# EAGLE board M.2 SoM breakout board v0.2-Placement-0305 (EAGLE 9.6.2), part 1 of 2
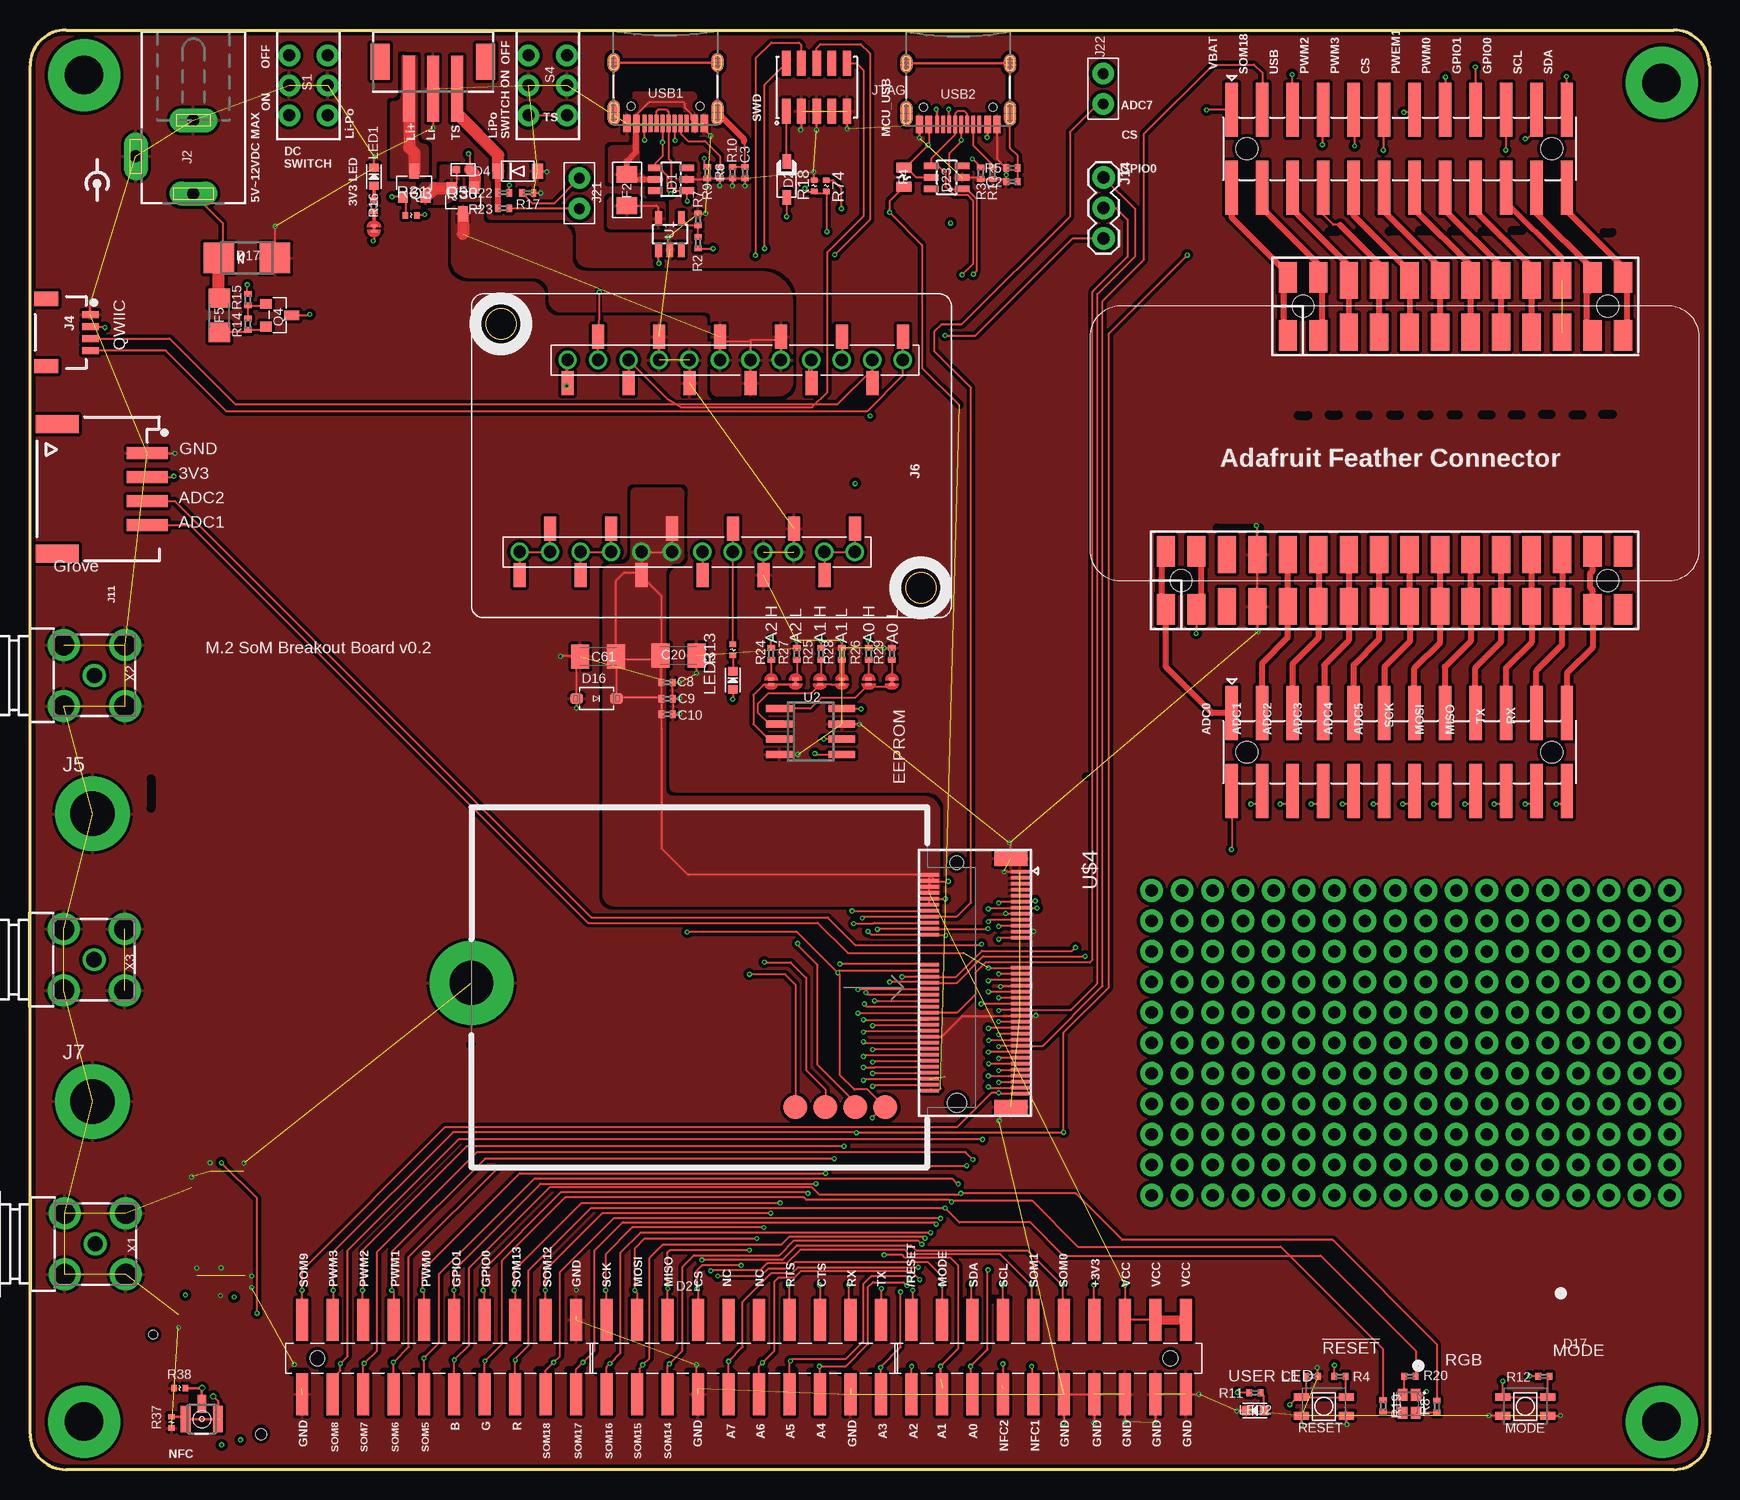
[diagram p3: board, top side]
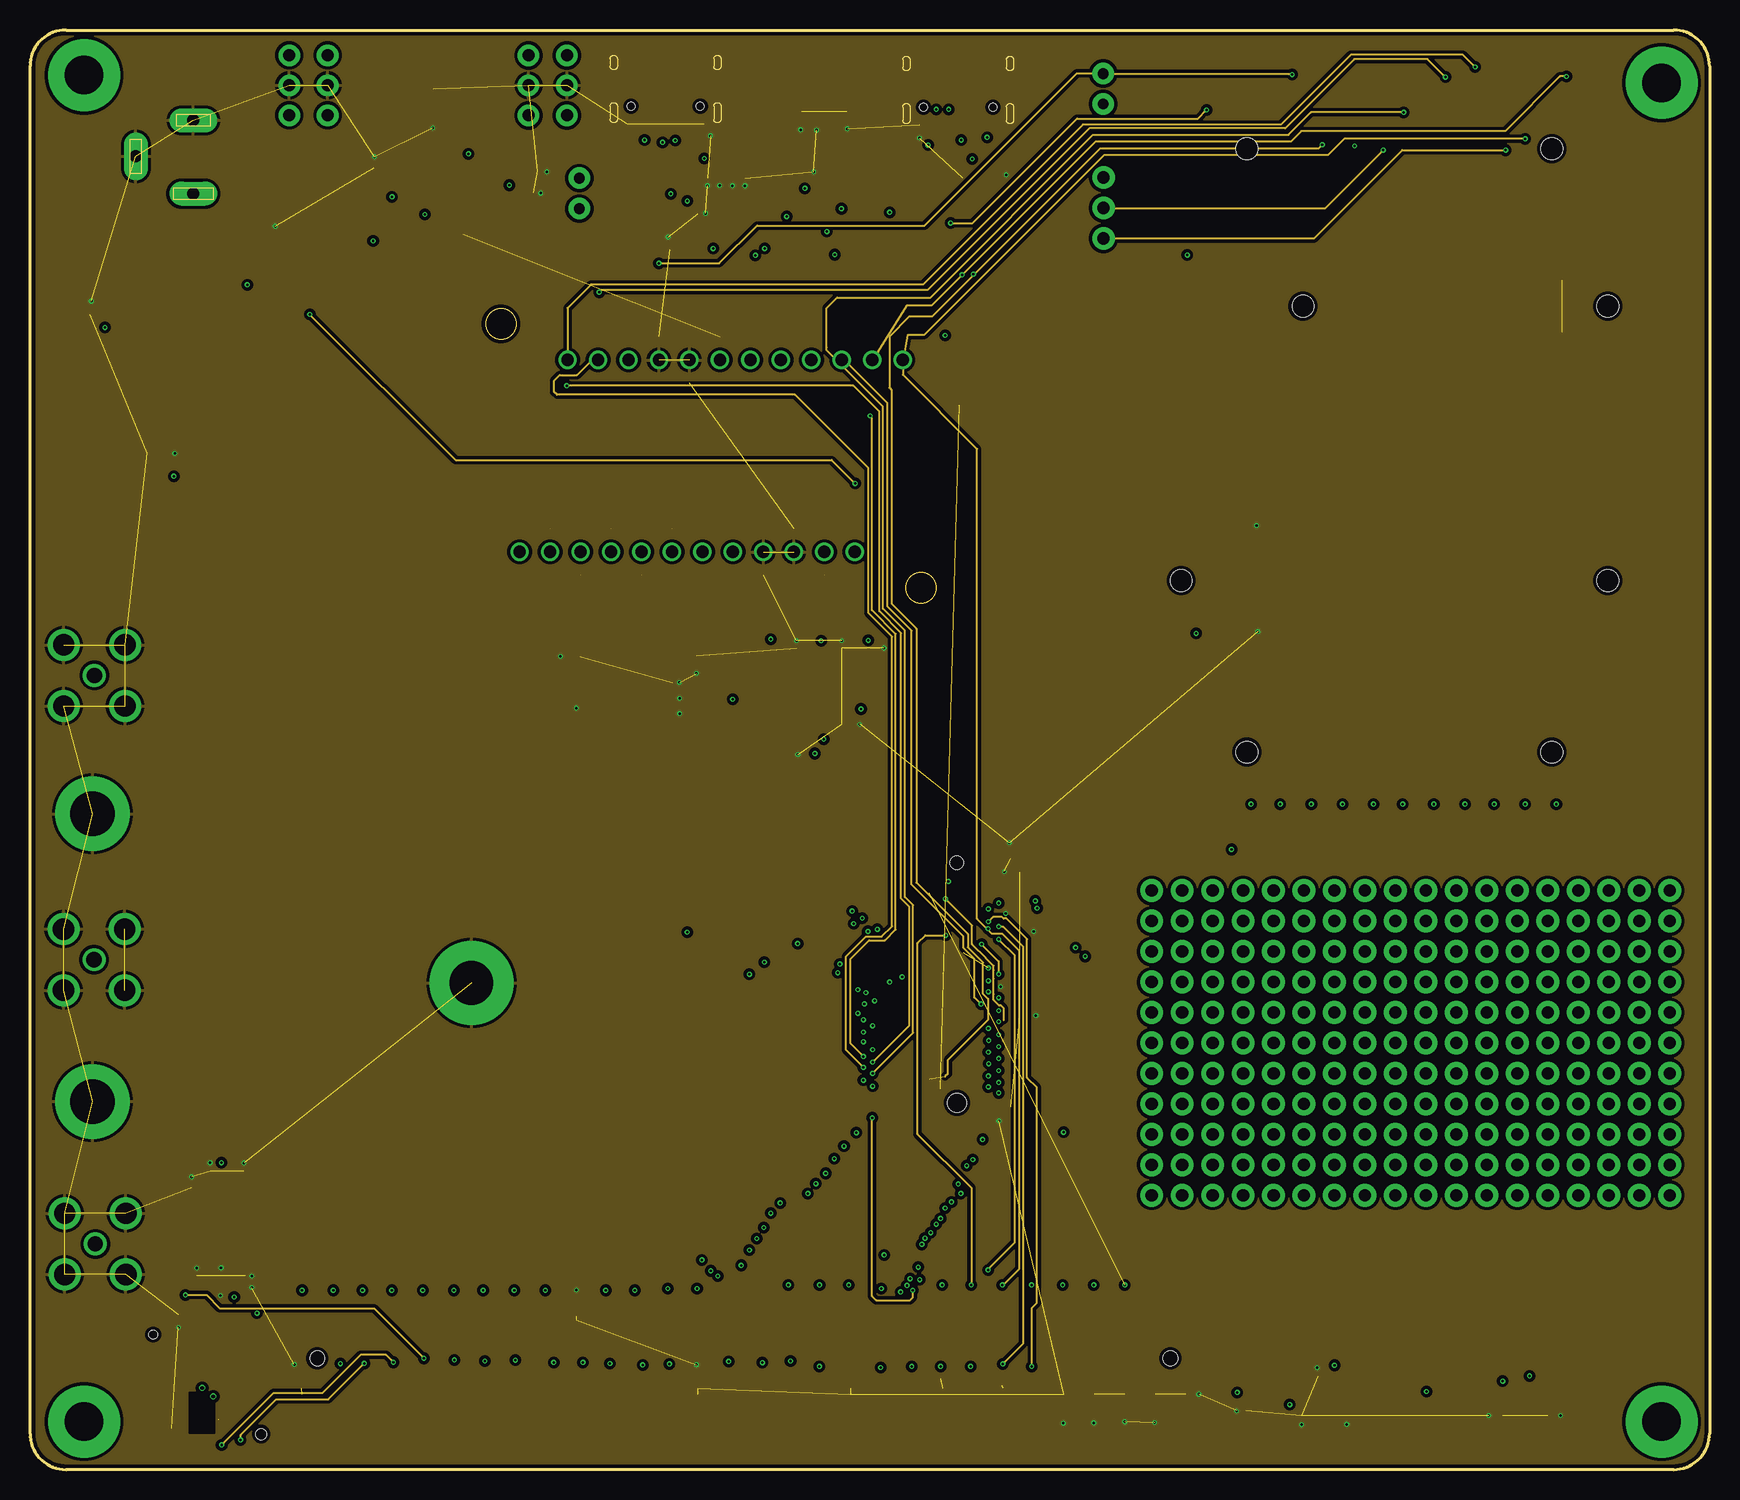
[diagram p4: board, inner layer GND]
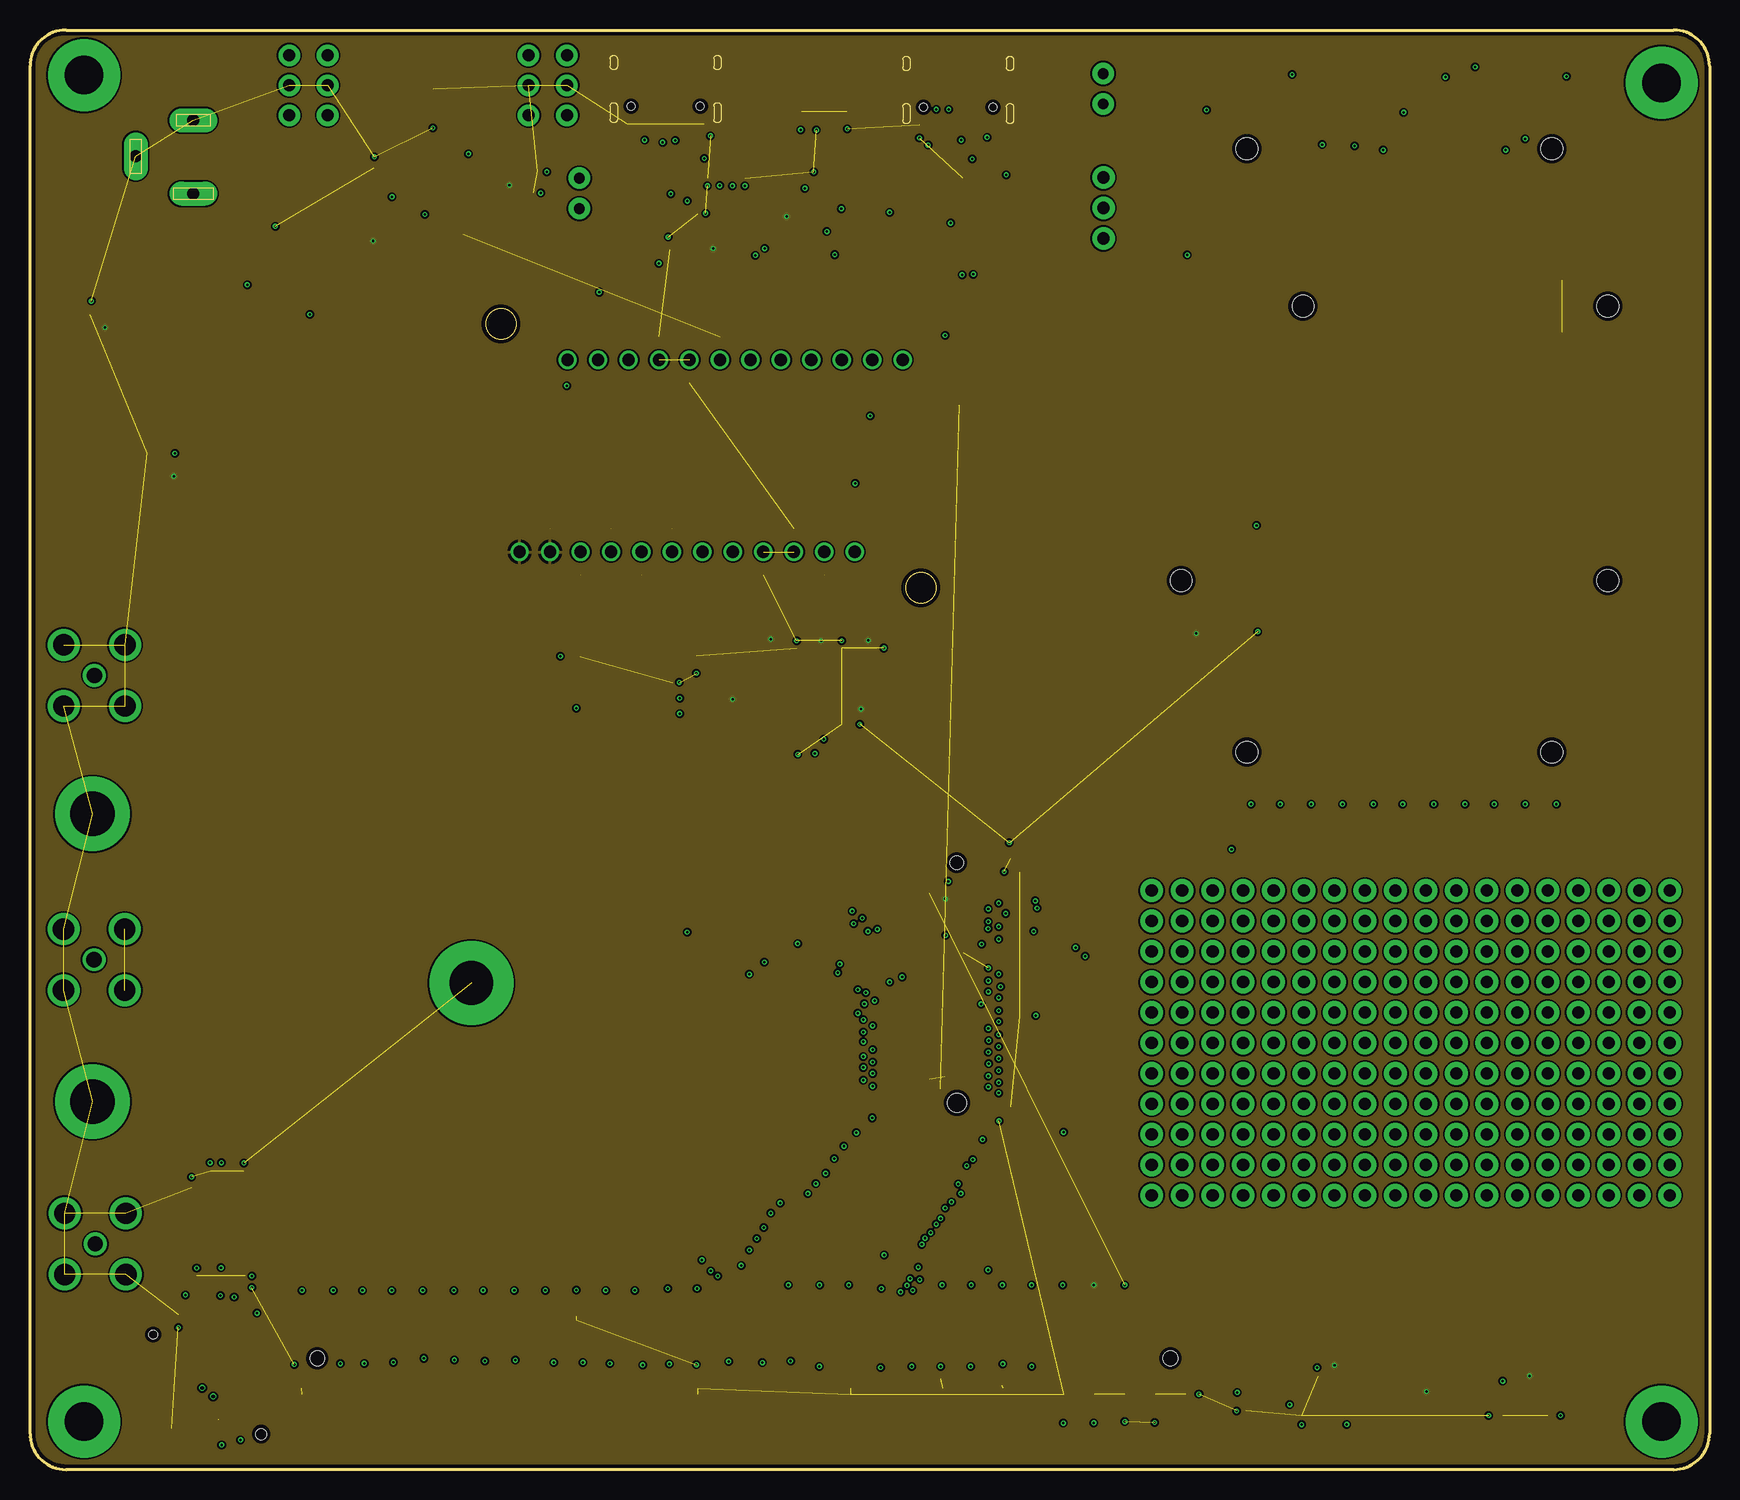
[diagram p5: board, inner layer Route15]
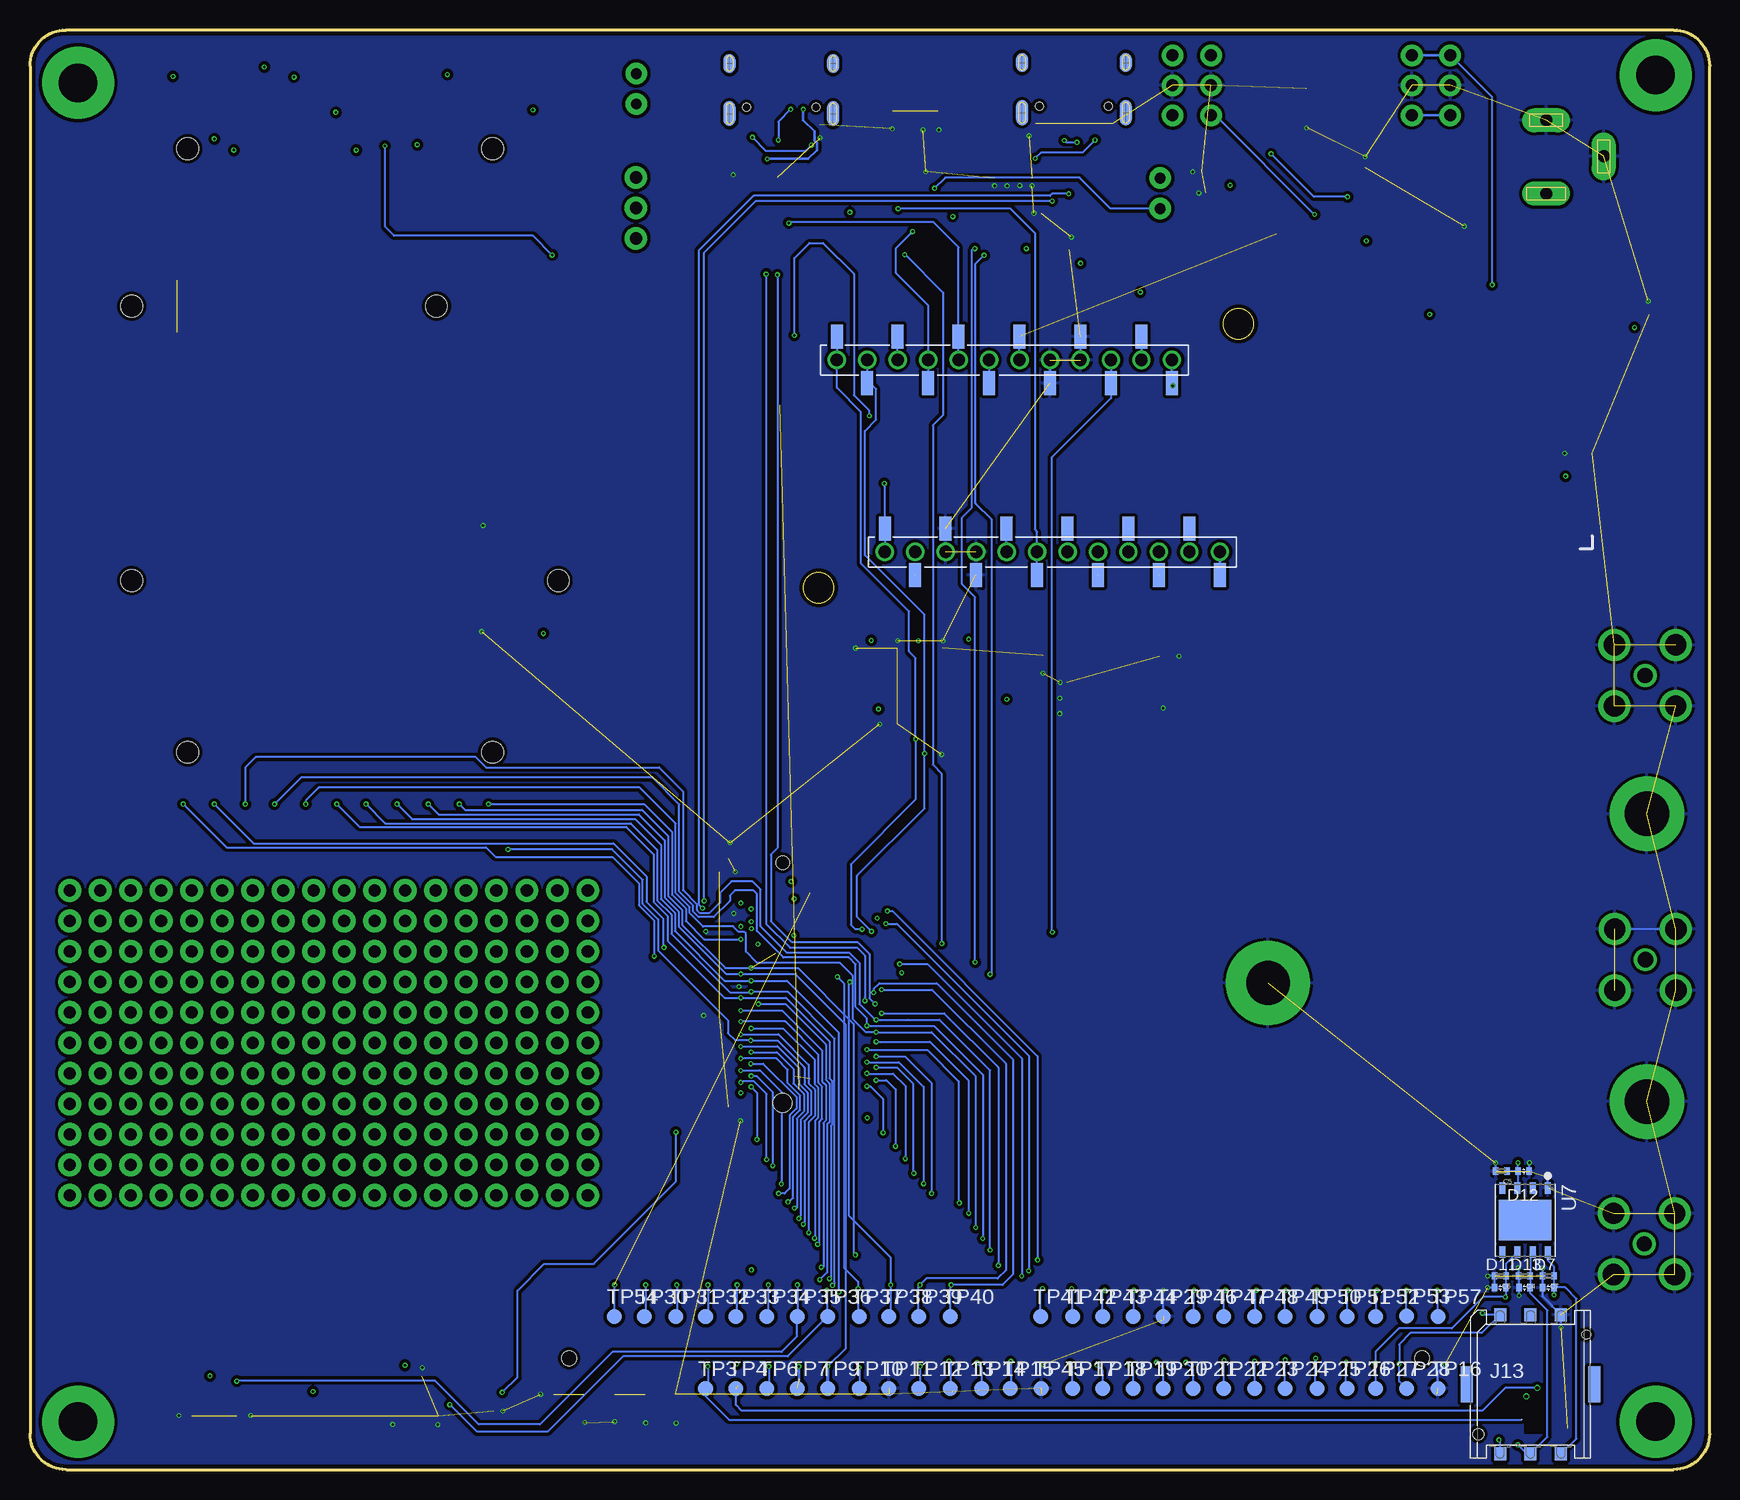
[diagram p6: board, bottom side, seen from below]

Size 140 x 120 mm. Coordinates in mm from the lower left corner, seen from the top.
Outline: 3,120 137,120 arc-90 140,117 140,3 arc-90 137,0 3,0 arc-90 0,3 0,117 arc-90 3,120
Copper layers (1+2*15+16): Top 0.035mm / dielectric 1.5mm / GND 0.035mm / dielectric 0.15mm / Route15 0.035mm / dielectric 0.2mm / Bottom 0.035mm
Design rules "default *": minimum track width 6mil, minimum drill 0.1mm, track to track 6mil, track to pad 6mil, pad to pad 6mil, via to via 6mil, smd to smd 6mil, copper to edge 12mil, drill to drill 6mil, minimum pad ring 4mil, minimum via ring 4mil, stop-mask expansion 4mil, vias tented up to drill 0.35mm, thermal gap 10mil
Net classes: 0 default: width 0.152 mm, clearance 0.152 mm; 1 power: width 0.254 mm, drill 0.61 mm, clearance 0.203 mm; 2 120R_Impedance: width 0.152 mm; 3 BAT: clearance 0.203 mm
tKeepout: 1 lines
tRestrict: 57 lines

## Footprints (pad centres in the part's own frame; a part is rotated, then mirrored left to right if it is on the bottom)
C0402_B = smd 0.457 x 0.61: 1 -0.483,0; 2 0.483,0
C1206K = smd 1.5 x 2: 1 -1.5,0; 2 1.5,0
SOT23-6 = smd 0.55 x 1.2: 1 -0.95,-1.3; 2 0,-1.3; 3 0.95,-1.3; 4 0.95,1.3; 5 0,1.3; 6 -0.95,1.3
SOD-123 = smd 1.2 x 0.7: 1 -1.5,0; 2 1.5,0
SOD-123FL = smd 0.91 x 1.22: A 1.637,0; C -1.637,0
C0402 = smd 0.45 x 0.6: 1 -0.47,0; 2 0.47,0
SOD-123' = smd 1.02 x 0.86: A 1.68,0; C -1.68,0
SMADIODE = smd 2.54 x 2.54: A 2.349,0; C -2.349,0
R1206 = smd 1.4 x 1.7: 1 -1.3,0; 2 1.3,0
F0805 = smd 0.85 x 1.25: P$1 -0.8,0; P$2 0.8,0
R1206' = smd 1.6 x 1.803: 1 -1.422,0; 2 1.422,0
JST-3-SMD-VERT = smd 1 x 5.5: 1 -2,0; 2 0,0; 3 2,0 | smd 1.6 x 3: PAD1 -4.4,-2.25; PAD2 4.4,-2.25
DCJ0202 = drill 1 pad 2 long: 1 0,3.1; 2 4.8,0; 3 0,-3
SPARK_CON_30X2_SMD = smd 1 x 3.5: 1 0,3.013; 2 0,-3.213; 3 2.54,3.013; 4 2.54,-3.213; 5 5.08,3.013; 6 5.08,-3.213; 7 7.62,3.013; 8 7.62,-3.213; 9 10.16,3.013; 10 10.16,-3.213; 11 12.7,3.013; 12 12.7,-3.213; 13 15.24,3.013; 14 15.24,-3.213; 15 17.78,3.013; 16 17.78,-3.213; 17 20.32,3.013; 18 20.32,-3.213; 19 22.86,3.013; 20 22.86,-3.213; 21 25.4,3.013; 22 25.4,-3.213; 23 27.94,3.013; 24 27.94,-3.213; 25 30.48,3.013; 26 30.48,-3.213; 27 33.02,3.013; 28 33.02,-3.213; 29 35.56,3.013; 30 35.56,-3.213; 31 38.1,3.013; 32 38.1,-3.213; 33 40.64,3.013; 34 40.64,-3.213; 35 43.18,3.013; 36 43.18,-3.213; 37 45.72,3.013; 38 45.72,-3.213; 39 48.26,3.013; 40 48.26,-3.213; 41 50.8,3.013; 42 50.8,-3.213; 43 53.34,3.013; 44 53.34,-3.213; 45 55.88,3.013; 46 55.88,-3.213; 47 58.42,3.013; 48 58.42,-3.213; 49 60.96,3.013; 50 60.96,-3.213; 51 63.5,3.013; 52 63.5,-3.213; 53 66.04,3.013; 54 66.04,-3.213; 55 68.58,3.013; 56 68.58,-3.213; 57 71.12,3.013; 58 71.12,-3.213; 59 73.66,3.013; 60 73.66,-3.213 | hole 1.2: 1.27,0; 72.39,0
1X04_1MM_RA = smd 0.6 x 1.35: 1 -1.5,0; 2 -0.5,0; 3 0.5,0; 4 1.5,0 | smd 1.2 x 2: NC1 2.8,-3.675; NC2 -2.8,-3.675
SCREW-HOLE-3.7 = drill 3.7 pad 6.2: P$1 0,0
PARTICLE-SZ_PARTICLE-POWER-MODULE = smd 1 x 2 bottom: 1 31.99,7.45; 2 29.45,3.55; 3 26.91,7.45; 4 24.37,3.55; 5 21.83,7.45; 6 19.29,3.55; 7 16.75,7.45; 8 14.21,3.55; 9 11.67,7.45; 10 9.13,3.55; 11 6.59,7.45; 12 4.05,3.55; 13 35.99,23.45; 14 33.45,19.55; 15 30.91,23.45; 16 28.37,19.55; 17 25.83,23.45; 18 23.29,19.55; 19 20.75,23.45; 20 18.21,19.55; 21 15.67,23.45; 22 13.13,19.55; 23 10.59,23.455; 24 8.05,19.55 | smd 1 x 2: @1 31.99,7.45; @2 29.45,3.55; @3 26.91,7.45; @4 24.37,3.55; @5 21.83,7.45; @6 19.29,3.55; @7 16.75,7.45; @8 14.21,3.55; @9 11.67,7.45; @10 9.13,3.55; @11 6.59,7.45; @12 4.05,3.55; @13 35.99,23.45; @14 33.45,19.55; @15 30.91,23.45; @16 28.37,19.55; @17 25.83,23.45; @18 23.29,19.55; @19 20.75,23.45; @20 18.21,19.55; @21 15.67,23.45; @22 13.13,19.55; @23 10.59,23.45; @24 8.05,19.55 | drill 1.016 pad 1.524: P$1 31.99,5.5; P$2 29.45,5.5; P$3 26.91,5.5; P$4 24.37,5.5; P$5 21.83,5.5; P$6 19.29,5.5; P$7 16.75,5.5; P$8 14.21,5.5; P$9 11.67,5.5; P$10 9.13,5.5; P$11 6.59,5.5; P$12 4.05,5.5; P$13 35.99,21.5; P$14 33.45,21.5; P$15 30.91,21.5; P$16 28.37,21.5; P$17 25.83,21.5; P$18 23.29,21.5; P$19 20.75,21.5; P$20 18.21,21.5; P$21 15.67,21.5; P$22 13.13,21.5; P$23 10.59,21.5; P$24 8.05,21.5
CON_12*2_SMD_HEADER = smd 1.02 x 4.5: 1 0,0.65; 2 0,-5.85; 3 2.54,0.65; 4 2.54,-5.85; 5 5.08,0.65; 6 5.08,-5.85; 7 7.62,0.65; 8 7.62,-5.85; 9 10.16,0.65; 10 10.16,-5.85; 11 12.7,0.65; 12 12.7,-5.85; 13 15.24,0.65; 14 15.24,-5.85; 15 17.78,0.65; 16 17.78,-5.85; 17 20.32,0.65; 18 20.32,-5.85; 19 22.86,0.65; 20 22.86,-5.85; 21 25.4,0.65; 22 25.4,-5.85; 23 27.94,0.65; 24 27.94,-5.85 | hole 1.8: 1.27,-2.6; 26.67,-2.6
WAFER-HY2.0-4PWB = smd 1 x 3.4: 1 -3,3.75; 2 -1,3.75; 3 1,3.75; 4 3,3.75 | smd 1.5 x 3.6: NC1 5.4,-3.75; NC2 -5.4,-3.75
TP_OPEN = smd 0.2 x 0.5: 1 -0.21,0; 2 0.21,0
GCT-SIM8100 = smd 1 x 1.1: C1 2.54,-5.8; C2 0,-5.8; C3 -2.54,-5.8; C5 2.54,5.8; C6 0,5.8; C7 -2.54,5.8 | smd 1 x 3: NC@1 -5.3,0; NC@2 5.3,0 | hole 0.7: 4.65,4.15 | hole 0.9: -4.35,-4.15
1X03 = drill 1.016 pad 1.88: 1 0,0; 2 2.54,0; 3 5.08,0
SIP-2 = drill 0.9 pad 1.8: 1 -1.27,0; 2 1.27,0
CONN5X2_1.27 = smd 0.7 x 2.1: 1 -2.54,-2; 2 -2.54,2; 3 -1.27,-2; 4 -1.27,2; 5 0,-2; 6 0,2; 7 1.27,-2; 8 1.27,2; 9 2.54,-2; 10 2.54,2
LED0603 = smd 0.7 x 0.8: 1 -0.75,0; 2 0.75,0
TACTILE_SWITCH_SMD = smd 1.25 x 0.65: 1 -1.875,0.775; 2 1.875,0.775; 3 -1.875,-0.775; 4 1.875,-0.775
FEATHERWING_SMT2 = smd 1.524 x 2.54: 1 6.35,2.413; 1' 6.35,-2.413; 2 8.89,2.413; 2' 8.89,-2.413; 15 41.91,2.413; 15' 41.91,-2.413; 16 44.45,2.413; 16' 44.45,-2.413; 17 44.45,20.447; 17' 44.45,25.273; 18 41.91,20.447; 18' 41.91,25.273; 27 19.05,20.447; 27' 19.05,25.273; 28 16.51,20.447; 28' 16.51,25.273 | smd 1.524 x 3.048: 3 11.43,2.159; 3' 11.43,-2.159; 4 13.97,2.159; 4' 13.97,-2.159; 5 16.51,2.159; 5' 16.51,-2.159; 6 19.05,2.159; 6' 19.05,-2.159; 7 21.59,2.159; 7' 21.59,-2.159; 8 24.13,2.159; 8' 24.13,-2.159; 9 26.67,2.159; 9' 26.67,-2.159; 10 29.21,2.159; 10' 29.21,-2.159; 11 31.75,2.159; 11' 31.75,-2.159; 12 34.29,2.159; 12' 34.29,-2.159; 13 36.83,2.159; 13' 36.83,-2.159; 14 39.37,2.159; 14' 39.37,-2.159; 19 39.37,20.701; 19' 39.37,25.019; 20 36.83,20.701; 20' 36.83,25.019; 21 34.29,20.701; 21' 34.29,25.019; 22 31.75,20.701; 22' 31.75,25.019; 23 29.21,20.701; 23' 29.21,25.019; 24 26.67,20.701; 24' 26.67,25.019; 25 24.13,20.701; 25' 24.13,25.019; 26 21.59,20.701; 26' 21.59,25.019 | hole 1.8: 17.78,22.86; 43.18,22.86; 7.62,0; 43.18,0
IPEX-20279-001E = smd 0.73 x 1.5: 1 0,1.28 | smd 0.8 x 2.2: 2@1 -1.35,0; 2@2 1.35,0
SOT-23 = smd 0.8 x 0.95: 1 -0.95,-1; 2 0.95,-1 | smd 0.8 x 1.25: 3 0,1.15
R0402_B = smd 0.457 x 0.61: 1 -0.483,0; 2 0.483,0
R-0402S = smd 0.45 x 0.55: 1 -0.47,0; 2 0.47,0
R0603 = smd 0.6 x 0.6: 1 -0.55,0; 2 0.55,0
PLCC4-2MM-RGB = smd 1 x 0.8: BLUE -0.75,-0.55; CA 0.75,-0.55; GREEN -0.75,0.55; RED 0.75,0.55
SWITCH-2.5X3.2-6 = drill 1 pad 1.8: 1 0,0; 2 0,2.5; 3 0,5; 4 3.2,0; 5 3.2,2.5; 6 3.2,5
TP_SHORT = smd 0.2 x 0.5: 1 -0.21,0; 2 0.21,0
B1,27 = smd 1.27 x 1.27: TP 0,0
SOT25 = smd 0.55 x 1.2: 1 -0.95,-1.3; 2 0,-1.3; 3 0.95,-1.3; 4 0.95,1.3; 5 -0.95,1.3
SO-08 = smd 0.6 x 2.2: 1 -1.905,-2.6; 2 -0.635,-2.6; 3 0.635,-2.6; 4 1.905,-2.6; 5 1.905,2.6; 6 0.635,2.6; 7 -0.635,2.6; 8 -1.905,2.6
MFF2 = smd 0.96 x 0.5: 1 -2.675,1.905; 2 -2.675,0.635; 3 -2.675,-0.635; 4 -2.675,-1.905; 5 2.675,-1.905; 6 2.675,-0.635; 7 2.675,0.635; 8 2.675,1.905 | smd 3.4 x 4.4: P$1 0,0
PARTICLE-STUDIOS_PARTICLE_M.2EKEY_3.65MM_DRILL = smd 0.3 x 1.55: 1 -9.62,3.735; 2 -9.37,-3.815; 3 -9.12,3.735; 4 -8.87,-3.815; 5 -8.62,3.735; 6 -8.37,-3.815; 7 -8.12,3.735; 8 -7.87,-3.815; 9 -7.62,3.735; 10 -7.37,-3.815; 11 -7.12,3.735; 12 -6.87,-3.815; 13 -6.62,3.735; 14 -6.37,-3.815; 15 -6.12,3.735; 16 -5.87,-3.815; 17 -5.62,3.735; 18 -5.37,-3.815; 19 -5.12,3.735; 20 -4.87,-3.815; 21 -4.62,3.735; 22 -4.37,-3.815; 23 -4.12,3.735; 32 -1.87,-3.815; 33 -1.62,3.735; 34 -1.37,-3.815; 35 -1.12,3.735; 36 -0.87,-3.815; 37 -0.62,3.735; 38 -0.37,-3.815; 39 -0.12,3.735; 40 0.13,-3.815; 41 0.38,3.735; 42 0.63,-3.815; 43 0.88,3.735; 44 1.13,-3.815; 45 1.38,3.735; 46 1.63,-3.815; 47 1.88,3.735; 48 2.13,-3.815; 49 2.38,3.735; 50 2.63,-3.815; 51 2.88,3.735; 52 3.13,-3.815; 53 3.38,3.735; 54 3.63,-3.815; 55 3.88,3.735; 56 4.13,-3.815; 57 4.38,3.735; 58 4.63,-3.815; 59 4.88,3.735; 60 5.13,-3.815; 61 5.38,3.735; 62 5.63,-3.815; 63 5.88,3.735; 64 6.13,-3.815; 65 6.38,3.735; 66 6.63,-3.815; 67 6.88,3.735; 68 7.13,-3.815; 69 7.38,3.735; 70 7.63,-3.815; 71 7.88,3.735; 72 8.13,-3.815; 73 8.38,3.735; 74 8.63,-3.815; 75 8.88,3.735 | smd 1.2 x 2.75: 76 9.98,2.96; 77 -10.72,2.96 | drill 3.65 pad 7: 78 -0.351,-42 | smd 2 x 2: !RESET 10,-7.5; SWCLK 10,-15; SWDIO 10,-12.5; SWO 10,-10 | hole 1.1: -10.37,-1.54 | hole 1.55: 9.63,-1.54
USB-C-16P = smd 0.3 x 1.45: A5 -1.25,0; A6 -0.25,0; A7 0.25,0; A8 1.25,0; B5 1.75,0; B6 0.75,0; B7 -0.75,0; B8 -1.75,0 | smd 0.6 x 1.45: GND -3.225,0; GND2 3.225,0 | smd 1 x 2.1: SHLD1 -4.32,-0.915; SHLD2 4.32,-0.915 | smd 1 x 2.1 bottom: SHLD3 -4.32,-0.915; SHLD4 4.32,-0.915 | smd 1 x 1.6: SHLD5 -4.32,-5.095; SHLD8 4.32,-5.095 | smd 1 x 1.6 bottom: SHLD6 -4.32,-5.095; SHLD7 4.32,-5.095 | smd 0.55 x 1.45: VBUS1 -2.45,0; VBUS2 2.45,0 | hole 0.65: -2.89,-1.445; 2.89,-1.445
BU-SMA-G = drill 1.27: 1 0,0 | drill 1.778: 2 -2.55,2.55; 3 2.55,2.55; 4 2.55,-2.55; 5 -2.55,-2.55

## Placement (x,y rotation side)
C1  0.1uF  [C0402_B]  106.88,7.78 0 top
C2  0.1uF  [C0402_B]  81.85,107.35 180 top
C3  0.1uF  [C0402_B]  59.61,108.11 270 top
C4  33pF  [C0402_B]  15.43,16.15 180 bottom
C5  33pF  [C0402_B]  17.35,24.87 180 bottom
C6  33pF  [C0402_B]  17.45,16.15 180 bottom
C7  0.1uF  [C0402_B]  13.43,16.15 180 bottom
C8  1nF  [C0402_B]  53.1,65.61 0 top
C9  100pF  [C0402_B]  53.11,64.26 0 top
C10  33pF  [C0402_B]  53.12,62.96 0 top
C20  100uF  [C1206K]  54.05,67.84 0 top
C61  100uF  [C1206K]  47.37,67.76 180 top
D1  TPESD0504S6  [SOT23-6]  53.44,107.55 90 top
D2  B5819w  [SOD-123]  63.07,107.54 90 top
D4  SMF3.3  [SOD-123FL]  40.67,108.23 0 top
D7  0402ESDA-05N  [C0402]  13.43,15.16 0 bottom
D11  0402ESDA-05N  [C0402]  17.45,15.16 0 bottom
D12  0402ESDA-05N  [C0402]  15.5,24.87 180 bottom
D13  0402ESDA-05N  [C0402]  15.42,15.16 0 bottom
D16  BZT52C3V9  [SOD-123']  47.23,64.27 180 top
D17  SMAJ15CA-13-F  [SMADIODE]  18.08,101 0 top
D23  DNP MAX3207EAUT+T  [SOT23-6]  76.42,107.7 90 top
F2  RF1512-000  [R1206]  49.76,106.67 270 top
F4  Fuse  [F0805]  72.84,107.73 90 top
F5  16V/0.75A  [R1206']  15.79,96.22 270 top
J1  [JST-3-SMD-VERT]  33.59,115.1 180 top
J2  DCJ0202  [DCJ0202]  13.62,109.46 180 top
J3  SPARK_CON_30X2_SMD  [SPARK_CON_30X2_SMD]  96.33,9.27 180 top
J4  [1X04_1MM_RA]  5.04,94.78 270 top
J5  SCREW-HOLE-3.7  [SCREW-HOLE-3.7]  5.21,54.66 0 top
J6  PARTICLE-SZ_PARTICLE-POWER-MODULE  [PARTICLE-SZ_PARTICLE-POWER-MODULE]  36.76,71 0 top
J7  SCREW-HOLE-3.7  [SCREW-HOLE-3.7]  5.21,30.68 0 top
J10  CON_122_SMD_HEADER  [CON_12*2_SMD_HEADER]  100.17,112.7 0 top
J11  WAFER-HY2.0-4PWB  [WAFER-HY2.0-4PWB]  6.02,81.74 270 top
J12  TP_OPEN  [TP_OPEN]  61.78,65.66 270 top
J13  SIM-NANO-4FF  [GCT-SIM8100]  14.92,7.11 0 bottom
J14  [1X03]  89.49,107.7 270 top
J15  CON_122_SMD_HEADER  [CON_12*2_SMD_HEADER]  100.17,62.4 0 top
J19  TP_OPEN  [TP_OPEN]  65.85,65.66 270 top
J20  TP_OPEN  [TP_OPEN]  69.91,65.66 270 top
J21  SIP-2  [SIP-2]  45.78,106.38 90 top
J22  SIP-2  [SIP-2]  89.46,115.09 90 top
JTAG  CONN5X2  [CONN5X2_1.27]  65.57,115.22 0 top
LED1  RED  [LED0603]  28.67,107.77 90 top
LED2  BLUE  [LED0603]  102.11,4.91 180 top
LED3  yellow  [LED0603]  58.59,65.79 90 top
MODE  [TACTILE_SWITCH_SMD]  124.65,5.26 180 top
MS1  PARTICLE_MESH_SMTDUAL  [FEATHERWING_SMT2]  88.34,74.11 0 top
NFC  UFL  [IPEX-20279-001E]  14.33,4.2 0 top
Q3  IR6401  [SOT-23]  36.1,105.82 180 top
Q4  IRLML6401  [SOT-23]  20.66,96.22 270 top
Q5  IR6401  [SOT-23]  32.03,107.09 0 top
R1  5.1k  [R0402_B]  80.24,108.06 270 top
R2  1K  [R0402_B]  55.68,102.27 270 top
R3  5.1k  [R0402_B]  79.25,108.06 270 top
R4  10K  [R0402_B]  109.2,7.78 180 top
R5  1M  [R0402_B]  81.85,108.5 180 top
R6  5.1k  [R0402_B]  57.52,108.11 270 top
R7  1M  [R0402_B]  55.68,104.21 90 top
R8  1K  [R0402_B]  117.26,5.25 270 top
R9  5.1k  [R0402_B]  56.47,108.11 270 top
R10  1M  [R0402_B]  58.56,108.11 270 top
R11  1K  [R0402_B]  102.11,6.4 180 top
R12  DNP  [R0402_B]  126.18,7.78 180 top
R13  1K  [R-0402S]  58.59,68.33 90 top
R14  100K  [R0402_B]  18.16,95.49 270 top
R15  1K  [R0402_B]  18.16,97.51 270 top
R16  1K  [R0402_B]  28.67,105.35 270 top
R17  10K  [R0402_B]  41.5,106.43 180 top
R18  nc  [R-0402S]  66.39,107.01 90 top
R19  1K  [R0402_B]  112.79,5.32 270 top
R20  1K  [R0402_B]  115.04,7.78 180 top
R22  1K  [R0402_B]  39.47,106.43 0 top
R23  0R  [R0402_B]  39.47,105.13 180 top
R24  10K  [R0402_B]  61.78,68 90 top
R25  10K  [R0402_B]  65.95,68 90 top
R26  10K  [R0402_B]  69.91,68 90 top
R27  100K  [R0402_B]  63.92,68 90 top
R28  100K  [R0402_B]  67.68,68 90 top
R29  100K  [R0402_B]  71.84,68 90 top
R30  100K  [R0603]  36.1,108.36 180 top
R31  1K  [R-0402S]  31.78,104.55 0 top
R37  ESD NC  [R-0402S]  11.8,3.92 270 top
R38  ESD NC  [R-0402S]  12.48,6.78 0 top
R74  nc  [R-0402S]  65.37,107.01 270 top
RESET  [TACTILE_SWITCH_SMD]  107.86,5.26 180 top
RGB  RGB-LED-CLMVB-FKARGB  [PLCC4-2MM-RGB]  114.95,5.47 90 top
S1  [SWITCH-2.5X3.2-6]  21.61,112.89 0 top
S4  [SWITCH-2.5X3.2-6]  44.76,117.89 180 top
T1  TP_SHORT  [TP_SHORT]  28.67,103.44 90 top
TP3  TPSB1,27  [B1,27]  83.69,6.76 0 bottom
TP4  TPSB1,27  [B1,27]  81.16,6.76 0 bottom
TP6  TPSB1,27  [B1,27]  78.59,6.76 0 bottom
TP7  TPSB1,27  [B1,27]  76.04,6.76 0 bottom
TP9  TPSB1,27  [B1,27]  73.5,6.76 0 bottom
TP10  TPSB1,27  [B1,27]  70.87,6.76 0 bottom
TP11  TPSB1,27  [B1,27]  68.4,6.76 0 bottom
TP12  TPSB1,27  [B1,27]  65.92,6.76 0 bottom
TP13  TPSB1,27  [B1,27]  63.3,6.76 0 bottom
TP14  TPSB1,27  [B1,27]  60.66,6.76 0 bottom
TP15  TPSB1,27  [B1,27]  58.29,6.76 0 bottom
TP16  TPSB1,27  [B1,27]  22.64,6.76 0 bottom
TP17  TPSB1,27  [B1,27]  53.08,6.76 0 bottom
TP18  TPSB1,27  [B1,27]  50.58,6.76 0 bottom
TP19  TPSB1,27  [B1,27]  48.03,6.76 0 bottom
TP20  TPSB1,27  [B1,27]  45.52,6.76 0 bottom
TP21  TPSB1,27  [B1,27]  43.03,6.76 0 bottom
TP22  TPSB1,27  [B1,27]  40.49,6.76 0 bottom
TP23  TPSB1,27  [B1,27]  37.91,6.76 0 bottom
TP24  TPSB1,27  [B1,27]  35.38,6.76 0 bottom
TP25  TPSB1,27  [B1,27]  32.69,6.76 0 bottom
TP26  TPSB1,27  [B1,27]  30.2,6.76 0 bottom
TP27  TPSB1,27  [B1,27]  27.81,6.76 0 bottom
TP28  TPSB1,27  [B1,27]  25.25,6.76 0 bottom
TP29  TPSB1,27  [B1,27]  45.52,12.77 0 bottom
TP30  TPSB1,27  [B1,27]  88.8,12.77 0 bottom
TP31  TPSB1,27  [B1,27]  86.15,12.77 0 bottom
TP32  TPSB1,27  [B1,27]  83.69,12.77 0 bottom
TP33  TPSB1,27  [B1,27]  81.16,12.77 0 bottom
TP34  TPSB1,27  [B1,27]  78.59,12.77 0 bottom
TP35  TPSB1,27  [B1,27]  76.04,12.77 0 bottom
TP36  TPSB1,27  [B1,27]  73.5,12.77 0 bottom
TP37  TPSB1,27  [B1,27]  70.87,12.77 0 bottom
TP38  TPSB1,27  [B1,27]  68.4,12.77 0 bottom
TP39  TPSB1,27  [B1,27]  65.92,12.77 0 bottom
TP40  TPSB1,27  [B1,27]  63.3,12.77 0 bottom
TP41  TPSB1,27  [B1,27]  55.75,12.77 0 bottom
TP42  TPSB1,27  [B1,27]  53.08,12.77 0 bottom
TP43  TPSB1,27  [B1,27]  50.58,12.77 0 bottom
TP44  TPSB1,27  [B1,27]  48.03,12.77 0 bottom
TP45  TPSB1,27  [B1,27]  55.7,6.76 0 bottom
TP46  TPSB1,27  [B1,27]  43.03,12.77 0 bottom
TP47  TPSB1,27  [B1,27]  40.49,12.77 0 bottom
TP48  TPSB1,27  [B1,27]  37.91,12.77 0 bottom
TP49  TPSB1,27  [B1,27]  35.38,12.77 0 bottom
TP50  TPSB1,27  [B1,27]  32.69,12.77 0 bottom
TP51  TPSB1,27  [B1,27]  30.2,12.77 0 bottom
TP52  TPSB1,27  [B1,27]  27.81,12.77 0 bottom
TP53  TPSB1,27  [B1,27]  25.25,12.81 0 bottom
TP54  TPSB1,27  [B1,27]  91.3,12.77 0 bottom
TP57  TPSB1,27  [B1,27]  22.64,12.77 0 bottom
U1  XC8107  [SOT25]  53.34,102.98 0 top
U2  AT24CS64-SSHM-B  [SO-08]  65.07,61.52 270 top
U7  NC  [MFF2]  15.37,20.79 270 bottom
U$2  TP_SHORT  [TP_SHORT]  63.82,65.66 270 top
U$3  TP_SHORT  [TP_SHORT]  67.68,65.66 270 top
U$4  PARTICLE-STUDIOS_M_SERIES_M.2KEY  [PARTICLE-STUDIOS_PARTICLE_M.2EKEY_3.65MM_DRILL]  78.8,40.2 270 top
U$6  PARTICLE-LOGO  [PARTICLE-LOGO]  16.37,72.5 0 top
U$7  TP_SHORT  [TP_SHORT]  71.84,65.66 270 top
USB1  [USB-C-16P]  52.98,112.19 180 top
USB2  [USB-C-16P]  77.37,112.12 180 top
X1  BU-SMA-G  [BU-SMA-G]  5.44,18.81 180 top
X2  BU-SMA-G  [BU-SMA-G]  5.37,66.19 180 top
X3  BU-SMA-G  [BU-SMA-G]  5.34,42.5 180 top

## Tracks (layer width: path | path; a pad name or v marks a point on that pad's centre or on a via)
5VDC  (2 unrouted)
  Top 0.152: J6.@10 J6.P$10 J6.P$9 J6.9
!MODE  (via drill 0.2, 0.2 pad 0.41)
  Top 0.152: U$4.32 74.98,42.13 v67.52,42.13 | J3.18 76.03,12.49 v76.03,15.39 76.03,16.1 74.83,17.3 63.76,17.3 63.22,16.76 61.55,16.76 60.91,16.13 v57.33,16.13 | R12.1 126.52,7.64 MODE.3 MODE.4 122.77,7.36 v122.76,7.37
  Bottom 0.152: v76.03,15.39 v76.02,15.39 76.02,12.79 TP35.TP 76.04,11.11 77.35,9.8 91.44,9.8 97.49,3.76 102.59,3.76 106.25,7.42 122.71,7.42 v122.76,7.37 | v67.52,42.13 65.17,42.13 57.33,34.29 v57.33,16.13
!RESET  (via drill 0.2, 0.2 pad 0.41)
  Top 0.152: U$4.34 67.41,41.57 67.34,41.5 v67.34,41.4 | J3.20 73.58,12.59 73.58,14.92 v73.59,14.94 | C1.1 106.39,6.45 106.09,6.15 | 106.09,6.15 RESET.4 RESET.3 109.68,6.09 R4.1 | JTAG.10 68.9,117.22 69.47,116.65 69.47,104.5 66.47,101.5 66.47,89.81 65.2,88.54 54.25,88.54 53.19,89.2 J6.P$22 J6.@22 | U$4.!RESET 71.24,30.27 | 71.24,30.27 69.83,31.67 68.71,31.67 67.49,32.89 67.49,41.25 v67.34,41.4 | v70.21,29.31 71.16,30.27 71.24,30.27 | v105.01,5.41 105.75,6.15 106.09,6.15 | v67.34,41.4 63.94,44.81 54.79,44.81 v54.78,44.79
  GND 0.152: v73.59,14.94 73.59,14.35 73.36,14.12 70.54,14.12 70.21,14.45 v70.21,29.31
  Bottom 0.152: v73.59,14.94 v73.58,14.93 73.58,12.85 TP36.TP 76.84,9.44 90.57,9.44 96.85,3.15 102.72,3.15 104.98,5.41 v105.01,5.41 | J6.@22 J6.P$22 49.89,89.31 54.8,84.39 54.8,44.82 v54.78,44.79 | v67.34,41.4 67.31,41.43
+3V3  (via drill 0.2, 0.2 pad 0.41)  (1 unrouted)
  Top 0.152: v88.67,15.39 v88.66,15.38 88.66,12.53 J3.8 | R25.2 v65.95,69.08 v65.94,69.09 | R26.2 69.91,69.08 v69.88,69.11 | R24.2 61.78,69.18 v61.75,69.22 | R2.2 v56.94,101.78 v56.95,101.78 | R4.2 108.71,8.66 v108.74,8.69 | RGB.CA 116.13,6.22 v116.41,6.5 | J4.2 6.17,95.28 v6.25,95.2 | J11.2 11.93,82.74 v11.99,82.8 | R22.2 39.95,107.05 v39.96,107.06 | T1.1 28.67,102.48 v28.6,102.41 | U2.8 69.24,63.43 v69.27,63.4 | R12.2 125.02,7.78 v125,7.8 | LED3.1 58.59,64.23 v58.58,64.21 | MS1.2' 97.23,69.72 v97.21,69.7 | v76.3,47.57 U$4.10 U$4.12 | D2.1 v63.07,104.45 v63.07,104.44 | MS1.2 97.67,76.09 97.67,75.74 | J6.@12 J6.P$12 J6.P$11 J6.@11
  Top 0.508: MS1.2' 97.23,71.79 97.67,72.23 97.67,75.74 97.67,76.96
  GND 0.152: v76.3,47.57 78.54,45.34 78.54,43.79 79.69,42.64 79.69,42.61 80.32,41.98 80.32,41.62 80.32,40.91 80.32,39.64 80.32,39.14 80.77,38.69 80.93,38.69 81.18,38.43 81.18,37.47
  Bottom 0.152: v88.67,15.39 v88.68,15.39 88.68,12.9 TP30.TP
  Bottom 0.203: J6.@12 J6.P$12
  pour Route15: -5.18,131.42 -5.18,-11.58 -4.65,-12.12 145.06,-12.12 146.51,-10.67 146.51,125.73 140.82,131.42
ADC0  (via drill 0.2 pad 0.41)
  Top 0.152: U$4.23 80.88,44.32 v80.75,44.2 | J15.4 102.71,55.65 102.54,55.47 v101.78,55.47 | J3.15 78.4,6.41 v78.4,8.6 79.81,10.02 79.81,16.59 v79.86,16.64
  GND 0.152: v79.86,16.64 79.86,16.69 82.09,18.92 82.09,42.85 v80.75,44.2
  Bottom 0.152: v101.78,55.47 88.8,55.47 86.49,53.16 86.49,47.93 85.32,46.76 85.32,45.72 83.8,44.2 v80.75,44.2 | v78.4,8.6 78.42,8.58 78.42,6.94 TP6.TP
ADC1  (via drill 0.2 pad 0.41)  (2 unrouted)
  Top 0.152: U$4.33 79.91,41.82 v79.89,41.8 | J15.6 105.25,55.59 105.13,55.47 v104.22,55.47 | v75.91,8.59 v75.9,8.6 77.39,10.09 77.39,16.97 76.71,17.65 72.95,17.65 72.72,17.88 v71.2,17.88 | 75.9,7.55 75.91,7.55 | J11.4 13.34,78.74 46.51,45.57 65.66,45.57 68.18,43.05 77.83,43.05
  Top 0.203: J3.17 76.01,6.28 75.9,6.39 v75.9,8.6
  Bottom 0.152: v71.2,17.88 71.35,18.03 71.35,37.16 76,41.81 79.88,41.81 v79.89,41.8 82.04,41.8 85.63,45.39 85.63,46.64 86.79,47.81 86.79,52.8 88.99,54.99 103.74,54.99 v104.22,55.47
  Bottom 0.203: v75.9,8.6 75.9,6.9 TP7.TP
ADC2  (via drill 0.2, 0.2 pad 0.41)
  Top 0.152: U$4.35 82.51,41.3 v80.75,41.3 | J15.8 107.79,55.85 107.42,55.47 v106.81,55.47 | v73.5,8.6 73.52,8.58 73.47,8.54 J3.19 | J11.3 12.08,80.74 46.78,46.04 66.49,46.04 68.79,43.74 79.28,43.74 v79.33,43.79
  GND 0.152: v79.33,43.79 80.75,42.37 v80.75,41.3
  Bottom 0.152: v106.81,55.47 105.95,54.61 89.27,54.61 87.1,52.44 87.1,47.68 85.93,46.51 85.93,45.26 81.97,41.3 v80.75,41.3 76.23,41.3 72.04,37.11 72.04,10.06 v73.5,8.59 TP9.TP v73.5,8.6 | v79.33,43.79 79.33,43.76
ADC3  (via drill 0.2 pad 0.41)
  Top 0.152: U$4.37 79.98,40.82 v79.89,40.73 | J15.10 110.33,55.65 110.16,55.47 v109.4,55.47 | J3.21 70.91,6.28 v70.91,8.49 v70.9,8.5 70.9,8.54 72.57,10.21 v72.57,14.81
  Bottom 0.152: v109.4,55.47 108.16,54.23 89.57,54.23 87.4,52.06 87.4,47.55 86.24,46.38 86.24,44.88 82.09,40.73 v79.89,40.73 79.88,40.74 76.91,40.74 72.6,36.43 72.6,14.96 72.57,14.94 v72.57,14.81 | v70.9,8.5 70.87,8.47 TP10.TP
ADC4  (via drill 0.2 pad 0.41)
  Top 0.152: U$4.41 v79.89,39.82 | J15.12 112.87,55.75 112.6,55.47 v111.99,55.47 | J3.25 65.85,8.55 v65.8,8.6 68.01,8.6 69.87,10.46 69.87,15.23 70.26,15.62 72.83,15.62 v73.1,15.34
  Bottom 0.152: v79.89,39.82 79.87,39.8 79.76,39.8 | v111.99,55.47 110.39,53.87 89.92,53.87 87.71,51.66 87.71,47.43 86.54,46.26 86.54,44.65 81.66,39.78 79.78,39.78 79.76,39.8 | v65.8,8.6 65.8,6.88 TP12.TP | v73.1,15.34 72.93,15.52 72.93,35.92 76.81,39.8 79.76,39.8
ADC5  (via drill 0.2 pad 0.41)
  Top 0.152: U$4.43 v80.75,39.32 | J15.14 115.41,55.54 115.34,55.47 v114.43,55.47 | J3.27 63.31,8.96 v63.4,9.05 63.55,9.2 67.97,9.2 69.47,10.7 69.47,15.47 70.11,16.1 73.16,16.1 v73.36,15.9
  Bottom 0.152: v114.43,55.47 112.53,53.57 90.3,53.57 88.01,51.28 88.01,47.3 86.84,46.13 86.84,44.07 82.09,39.32 v80.75,39.32 76.99,39.32 73.36,35.69 73.36,32.62 73.16,32.41 73.16,28.73 73.23,28.66 73.23,16.03 v73.36,15.9 | TP13.TP 63.27,6.79 63.27,8.92 v63.4,9.05
ADC6  (via drill 0.2 pad 0.41)
  Top 0.152: U$4.45 79.3,38.82 v79.28,38.8 | J3.29 60.77,8.62 v61.05,8.9 62.06,9.91 62.06,15.68 62.38,16 63.73,16 64.29,16.56 73.43,16.56 v74.17,15.82 | J6.15 J6.P$15
  GND 0.152: J6.P$15 67.67,92.68 71.46,88.89 71.46,71.95 73.48,69.92 73.48,48.77 77.8,44.45 77.8,43.48 78.72,42.57 78.72,39.34 79.25,38.8 v79.28,38.8
  Bottom 0.152: v79.28,38.8 77.03,38.8 73.67,35.44 73.67,32.49 73.36,32.19 73.36,28.96 73.56,28.76 73.56,16.43 v74.17,15.82 | TP14.TP 60.67,6.77 60.67,8.52 v61.05,8.9 | J6.P$15 J6.15
ADC7  (via drill 0.2 pad 0.41)
  Top 0.152: v80.75,38.25 80.82,38.32 U$4.47 86.76,38.32 88.98,40.54 88.98,97.99 92.13,101.14 92.13,105.06 J14.1 | J3.31 v58.23,9.02 58.23,9.03 59.41,10.21 59.41,13.97 61.83,16.38 63.53,16.38 64.01,16.87 73.56,16.87 73.61,16.82 73.99,16.82 v74.04,16.87
  Bottom 0.152: v80.75,38.25 77.3,38.25 73.97,34.93 73.97,32.37 73.67,32.06 73.67,29.08 73.87,28.88 73.87,16.87 v74.04,16.87 | TP15.TP 58.24,6.81 58.24,9.01 v58.23,9.02
CHARGE
  Top 0.152: J6.P$5 58.59,78.21 | 58.59,78.21 J6.@5 | R13.2 58.59,78.2 58.59,78.21
  Bottom 0.152: J6.P$5 J6.@5
CS  (via drill 0.2 pad 0.41)
  Top 0.152: v69.01,38.03 69.06,38.07 U$4.48 77.27,38.07 78.8,39.6 78.8,41.42 79.64,42.27 88.34,42.27 88.57,42.49 88.57,98.17 91.49,101.09 91.49,104.2 90.53,105.16 J14.2 | J3.34 55.69,15 v55.6,15.09 55.6,16.59 56.03,17.02 v59.29,17.02 | J10.11 112.8,113.28 v112.8,109.98
  GND 0.152: v112.8,109.98 107.98,105.16 J14.2 89.31,105.16
  Bottom 0.152: TP41.TP 55.75,14.94 v55.6,15.09 | v69.01,38.03 63.81,38.03 59.29,33.51 v59.29,17.02
CTS  (via drill 0.2 pad 0.41)
  Top 0.152: U$4.40 74.93,40.02 69.04,40.02 v69.01,40 | v65.81,15.39 65.85,15.35 J3.26
  Bottom 0.152: TP39.TP 65.92,15.28 v65.81,15.39 65.28,15.93 59.34,15.93 58.65,16.61 58.65,33.84 64.81,40 v69.01,40
GND  (via drill 0.2, 0.2 pad 0.41)  (89 unrouted)
  Top 0.152: D23.2 79.13,107.7 R3.2 R1.2 81.14,107.58 C2.2 v81.37,107.92 R5.2 80.6,109.27 USB2.GND | J6.P$21 J6.21 | J6.P$20 J6.@20 | U2.4 v64.01,59.62 v64.01,59.61 | v69.17,62.13 67.7,62.13 U2.7 | LED2.2 101.33,4.88 v100.59,4.88 | J3.1 97.42,6.26 v97.44,6.27 | v83.85,37.85 83.82,37.82 U$4.49 77.73,37.82 75.98,36.07 U$4.56 | C9.2 C8.2 v54.13,65.61 | C9.2 53.6,64.25 C10.2 54.09,62.96 v54.16,63.02 | C9.2 54.12,64.26 v54.16,64.29 | C20.2 v55.55,66.37 | C61.2 45.9,67.79 45.8,67.79 | 45.8,67.79 v44.22,67.79 | 45.8,67.79 45.55,67.54 D16.A v45.55,63.48 | USB2.GND2 v74.15,111 | JTAG.9 68.11,111.78 v68.12,111.76 | JTAG.5 v65.57,111.67 v65.56,111.66 | JTAG.3 64.3,111.74 v64.24,111.68 | LED1.2 28.67,109.39 v28.7,109.42 | R17.1 42.55,106.43 v42.57,106.4 | D4.A 43.03,108.23 v43.08,108.18 | J11.1 12.04,84.74 v12.07,84.71 | D17.A 20.43,103.61 v20.45,103.63 | USB1.GND 56.21,111.69 v56.72,111.18 | D1.2 56.39,107.55 R9.2 | R9.2 R6.2 | R6.2 57.54,107.6 58.53,107.6 R10.2 | R10.2 C3.2 59.61,107.03 v59.59,107.01 | R9.2 v56.47,107.01 | R28.2 v67.68,69.08 v67.67,69.09 | C1.2 107.36,8.42 v107.29,8.48 | RESET.2 106,4.47 v106,3.73 | RESET.1 109.73,3.78 v109.76,3.76 | MODE.2 v121.6,4.49 v121.59,4.5 | MODE.1 v127.58,4.49 v127.59,4.5 | v102.24,78.69 102.31,78.62 MS1.4 MS1.4' 102.31,69.88 v102.34,69.85 | R10.2 58.55,107.62 v58.55,107.01 | R6.2 57.52,107.07 v57.48,107.04 | v55.55,8.74 55.55,6.96 55.69,6.82 J3.33 | R27.2 v63.92,69.08 v63.91,69.09 | R29.2 v71.18,68.48 v71.17,68.48 | R7.2 56.28,104.69 v56.31,104.72 | U1.2 53.19,101.83 v53.19,102.74 | U$4.76 80.78,29.24 v80.78,29.06 | U$4.77 81.76,52.13 v81.64,52.25 | U$4.1 v81.22,49.82 v81.21,49.84 | v86.13,3.86 86.17,3.9 J3.9 88.66,6.26 88.71,6.2
  Top 0.152: J3.7 88.71,6.2 | 88.71,6.2 88.71,3.93 v88.67,3.89 | J3.5 v91.25,4 v91.27,3.99 | J3.3 93.79,3.95 v93.75,3.91 | R74.1 65.38,108.14 v65.33,108.18 | J1.2 v33.59,111.84 v33.58,111.84 | J4.1 5.04,97.34 v5.11,97.41 | U$4.21 83.64,44.82 v83.67,44.86 | U$4.15 81.37,46.32 v81.33,46.35 | J6.P$3 J6.@3 | J6.@4 J6.P$4 | U$4.39 82.47,40.25 v80.9,40.25
  Bottom 0.152: J6.21 J6.P$21 | J6.P$20 J6.@20 | X3.5 X3.4 | D12.1 15.03,25.57 v15.01,25.58 | U7.1 v13.47,24.38 v13.46,24.38 | v13.9,16.79 13.9,16.17 C7.2 13.9,16.14 D7.1 13.9,14.43 J13.C5 v12.38,11.84 v12.37,11.84 | v18.49,16.13 17.95,16.13 C6.2 17.93,15.17 D11.1 v18.49,15.16 | v15.93,16.82 15.91,16.8 C4.2 15.89,16.13 D13.1 15.89,14.52 v15.88,14.5 | C5.2 v17.83,25.55 | TP29.TP 45.52,14.94 v45.55,14.96 | TP16.TP 22.64,8.14 v22.02,8.76
  pour Top (isolate 0.279, rank 3): 0.03,119.95 0.03,0 139.93,0 139.93,119.95
  pour GND (isolate 0.279, rank 3): 0.03,120.05 0.03,0 139.93,0 139.93,120.05
  pour Bottom (isolate 0.279, rank 3): 0.03,130.05 0.03,0 139.91,0 139.91,130.05
  cutout Bottom: 13.31,6.38 13.31,3.07 15.34,3.07 15.34,6.38
  cutout GND: 13.31,6.38 13.31,3.07 15.34,3.07 15.34,6.38
  cutout Top: 13.31,6.38 13.31,3.07 15.34,3.07 15.34,6.38
GND1  (via drill 3.2 pad 6)
  other vias: 136,115.6
GND2  (via drill 3.2 pad 6)
  other vias: 4.5,116.23
GND3  (via drill 3.2 pad 6)
  other vias: 4.5,4
GND4  (via drill 3.2 pad 6)
  other vias: 136,4
GPIO0  (via drill 0.2, 0.2 pad 0.41)
  Top 0.152: U$4.62 74.93,34.52 69.56,34.52 v69.47,34.43 | J3.48 37.91,14.79 v37.77,14.94 37.77,16.61 44.25,23.09 64.77,23.09 v64.85,23.01 | v123.02,109.98 123.03,110 J10.19 | J14.3 86.9,102.62 78.82,94.54 v76.28,94.54
  GND 0.152: v69.47,34.43 68.41,35.5 68.41,42.57 69.94,44.11 71.26,44.11 72.16,45.01 72.16,69.65 70.18,71.63 70.18,87.68 v70.03,87.83 | J14.3 107.02,102.62 114.39,109.98 v123.02,109.98
  Bottom 0.152: v37.77,14.94 37.91,14.79 TP48.TP | v69.47,34.43 67.06,34.43 64.85,32.22 v64.85,23.01 | v70.03,87.83 70.03,88.27 71.33,89.56 71.33,99.67 73.89,102.23 75.03,102.23 76.28,100.99 v76.28,94.54
GPIO1  (via drill 0.2 pad 0.41)
  Top 0.152: U$4.64 74.93,34.02 70.3,34.02 v70.23,33.95 | J3.50 35.33,12.52 v35.33,14.94 35.33,16.61 42.55,23.82 v65.52,23.82 | J6.24 J6.P$24 44.81,92.66 44.73,92.58 v44.73,90.35 | J10.17 120.49,116.9 v120.47,116.92
  GND 0.152: v120.47,116.92 119.43,117.96 110.11,117.96 104.27,112.12 87.76,112.12 74.42,98.78 46.76,98.78 44.81,96.83 J6.P$24 | v70.23,33.95 73.31,37.03 73.31,46.92 72.62,47.6 72.62,69.72 70.79,71.55 70.79,88.19 68.63,90.35 v44.73,90.35
  Bottom 0.152: TP49.TP 35.38,14.88 v35.33,14.94 | v70.23,33.95 67.57,33.95 65.52,31.9 v65.52,23.82 v65.51,23.82 | J6.24 J6.P$24
LED_BLUE  (via drill 0.2 pad 0.41)
  Top 0.152: U$4.65 v79.91,33.82 v79.91,33.83 | J3.49 v35.37,9.14 36.59,10.35 36.59,16.8 43.31,23.52 65.2,23.52 65.81,22.91 77.5,22.91 v77.6,23.01 87.17,23.01 91.06,19.13 108.59,19.13 117.26,10.45 R8.1
  Bottom 0.152: v79.91,33.83 78.88,33.83 76.1,31.05 76.1,30.09 76.69,29.51 76.69,23.42 77.09,23.01 v77.6,23.01 | TP24.TP 35.38,9.13 v35.37,9.14
LED_BLUE1
  Top 0.152: RGB.BLUE 115.46,4.77 R8.2
LED_GREEN  (via drill 0.2 pad 0.41)
  Top 0.152: U$4.63 80.81,34.32 v80.75,34.27 | J3.47 v37.91,9.04 39.35,10.47 39.35,17.43 44.61,22.68 64.52,22.68 64.72,22.48 76.63,22.48 v76.81,22.3 76.91,22.4 83.54,22.4 87.37,18.58 104.25,18.58 112.79,10.04 R19.1
  Bottom 0.152: v80.75,34.27 77.78,34.27 76.84,33.33 76.84,32.22 75.8,31.18 75.8,29.97 76.38,29.39 76.38,22.63 76.71,22.3 v76.81,22.3 | TP23.TP v37.91,9.04
LED_GREEN1
  Top 0.152: RGB.GREEN 112.9,4.72 R19.2
LED_RED  (via drill 0.2 pad 0.41)
  Top 0.152: v79.89,34.79 79.92,34.82 U$4.61 | J3.45 v40.45,9.12 40.45,9.23 41.58,10.36 41.58,16.61 46.76,21.79 v76.28,21.79 77.48,20.6 83.39,20.6 86.16,17.83 107.6,17.83 115.52,9.91 R20.1
  Bottom 0.152: v79.89,34.79 77.74,34.79 76.36,33.41 76.36,32.17 75.49,31.3 75.49,29.84 76.08,29.26 76.08,21.79 v76.28,21.79 | TP22.TP 40.49,9.08 v40.45,9.12
LED_RED1
  Top 0.152: R20.2 114.55,6.38 RGB.RED
LI+
  Top 0.508: J10.2 100.17,104.36 104.85,99.69 MS1.28' 104.79,99.38 104.51,99.1 104.51,94.84 104.79,94.56 MS1.28
MISO  (via drill 0.2 pad 0.41)
  Top 0.152: U$4.50 74.9,37.48 v69.47,37.48 | J3.36 53.16,12.49 v53.16,15.09 53.16,18.14 53.32,18.29 v59.97,18.29 | J15.20 123.03,55.7 122.81,55.47 v122.05,55.47
  Bottom 0.152: v53.16,15.09 53.16,12.85 TP42.TP | v122.05,55.47 122.05,58.52 121.19,59.38 102.84,59.38 101.97,58.52 87.56,58.52 85.58,56.54 85.58,48.31 84.38,47.12 84.38,46.61 84.13,46.35 83.39,46.35 82.48,47.27 82.48,48.08 81.54,49.02 79.78,49.02 79.1,48.34 79.1,45.29 76.89,43.08 71.71,43.08 70.87,42.24 70.87,38.81 69.54,37.48 v69.47,37.48 66.81,37.48 | 66.82,37.49 66.81,37.48 | v59.97,18.29 59.97,33.28 64.17,37.48 66.81,37.48
MOSI  (via drill 0.2 pad 0.41)
  Top 0.152: U$4.52 74.92,37.01 70.26,37.01 v70.23,36.98 | J3.38 50.61,14.74 v50.42,14.94 50.42,18.44 51.24,19.25 v60.58,19.25 | J15.18 120.49,55.59 120.37,55.47 v119.61,55.47
  Bottom 0.152: TP43.TP 50.58,14.77 v50.42,14.94 | v60.58,19.25 60.58,32.91 64.65,36.98 v70.23,36.98 70.23,37.62 71.17,38.56 71.17,42.11 71.73,42.67 77.19,42.67 79.4,44.88 79.4,47.98 79.71,48.28 81.23,48.28 81.66,47.85 81.66,47.4 83.01,46.05 84.25,46.05 84.71,46.51 84.71,47.02 85.88,48.19 85.88,55.45 88.12,57.68 117.4,57.68 v119.61,55.47
N$1
  Top 0.152: USB2.A5 78.62,110.38 80.24,108.76 R1.1
N$2  (via drill 0.2 pad 0.41)
  Top 0.152: R3.1 v78.55,109.25
  Top 0.203: USB2.B5 75.62,113.31 v75.54,113.39
  Bottom 0.203: v75.54,113.39 75.54,112.5 74.6,111.56 74.6,110.78 74.41,110.59 74.41,109.97 75.13,109.25 v78.55,109.25
N$3
  Top 0.152: USB2.SHLD3 81.69,110.16 82.34,109.51 82.34,108.64 R5.1 C2.1
  Top 0.203: USB2.SHLD3 USB2.SHLD6 USB2.SHLD8
N$4
  Top 0.152: USB1.A5 54.23,111.35 54.84,110.74 56.26,110.74 57.52,109.49 R6.1
N$5  (via drill 0.2 pad 0.41)
  Top 0.152: v51.23,110.82 USB1.B5 | R9.1 56.21,108.85 v56.21,109.3
  Bottom 0.152: v56.21,109.3 55.7,109.8 52.25,109.8 v51.23,110.82
N$6
  Top 0.152: JTAG.1 63.03,109.09 D2.2
N$7
  Top 0.152: D4.C 38.98,108.18 R22.1 R23.2
  Top 0.508: 39.03,109.57 38.98,109.53 R23.2
  Top 1: J1.1 35.59,113.01 39.03,109.57 D4.C
N$8
  Top 0.152: R10.1 C3.1 59.61,110.8 59.51,110.9
  Top 0.203: USB1.SHLD2 USB1.SHLD8 USB1.SHLD6 USB1.SHLD3
  Top 0.508: USB1.SHLD3 59.51,110.9 59.52,110.89 59.52,110.69
N$9
  Top 0.152: U1.4 54.84,103.73 R7.1 R2.1
N$10
  Top 0.152: 36.8,35.5 36.7,35.4
N$11
  Top 0.152: Q4.2 19.4,95.01 R14.2 17.95,94.8 F5.2
N$13
  Top 0.152: R13.1 LED3.2
N$16
  Top 0.457: 115.01,100.31 MS1.24' MS1.24
  Top 0.508: 115.34,100.13 115.01,99.79 115.01,100.31 114.58,100.31 110.31,104.57 110.31,106.83 J10.10
N$17
  Top 0.152: R14.1 R15.2 19.51,97.03 Q4.1
N$18  (via drill 0.2 pad 0.41)
  Top 0.152: R15.1 18.11,98.04 v18.11,98.75
  Bottom 0.152: v18.11,98.75 18.11,114.39 S1.3
  Bottom 0.203: S1.3 S1.6
N$19
  Top 0.305: LED1.1 R16.1
N$21
  Top 0.508: J15.3 102.71,67.23 104.83,69.34 104.83,71.93 MS1.5' MS1.5
N$23
  Top 0.508: J15.5 105.25,67.18 107.42,69.34 107.42,72.85 | 107.42,72.85 107.39,72.82 MS1.6' | MS1.6 107.42,76.24 107.42,72.85
N$24
  Top 0.508: MS1.7 MS1.7' 109.93,69.11 107.88,67.06 107.88,63.13 J15.7
N$25
  Top 0.508: J15.9 110.33,65.51 110.33,67.08 112.47,69.21 MS1.8' MS1.8
N$26
  Top 0.152: J15.11 112.91,63.02 112.91,62.64
  Top 0.508: MS1.9 MS1.9' 115.01,69.01 112.91,66.9 112.91,62.64 113.06,62.48
N$27
  Top 0.508: J15.13 115.41,66.82 117.55,68.96 MS1.10' MS1.10
N$28
  Top 0.508: MS1.11 MS1.11' 120.09,69.06 117.94,66.9 117.94,63.07 J15.15
N$29
  Top 0.508: J15.17 120.49,66.87 122.63,69.01 MS1.12' MS1.12
N$30
  Top 0.508: MS1.13 MS1.13' 125.17,68.96 123.03,66.82 J15.19
N$31
  Top 0.508: MS1.14 MS1.14' 127.71,68.75 125.57,66.62 J15.21
N$32
  Top 0.508: MS1.15 130.25,74.9 130.06,74.71 130.06,73.51 130.25,73.32 MS1.15' 130.25,68.53 128.11,66.39 J15.23
N$33
  Bottom 0.203: S1.1 S1.4
N$34
  Top 0.508: MS1.17 133.13,94.56 133.13,98.95 132.79,99.29 MS1.17' 132.79,100.25 128.11,104.93 J10.24
N$35
  Top 0.508: MS1.18 130.25,94.96 129.76,95.45 129.76,98.03 130.25,98.53 MS1.18' 130.25,100.06 125.57,104.74 J10.22
N$36
  Top 0.152: LED2.1 102.86,6.13 R11.1
N$37  (1 unrouted)
  Top 0.305: 127.71,100.97 MS1.19'
  Top 0.406: J10.20 123.03,105.65 127.71,100.97
N$38
  Top 0.508: MS1.20 MS1.20' 125.17,100.25 120.49,104.93 J10.18
N$39
  Top 0.508: MS1.21 MS1.21' 122.63,100.3 117.95,104.98 J10.16
N$40
  Top 0.508: MS1.22 MS1.22' 120.09,100.41 115.41,105.08 J10.14
N$41
  Top 0.152: MS1.23' 117.55,100.21
  Top 0.508: MS1.23 117.55,99.44 | 117.78,99.67 117.55,99.44 | J10.12 112.87,104.88 117.55,100.21 117.55,99.44
N$42
  Top 0.152: 109.2,103.76 108.64,103.76 107.79,104.6 J10.8
  Top 0.508: MS1.25 MS1.25' 112.47,100.49 109.2,103.76
N$43
  Top 0.508: J10.4 102.71,105.14 107.39,100.46 MS1.27' 107.45,99.38 107.73,99.1 107.73,94.84 107.45,94.56 MS1.27
N$44
  Top 0.305: T1.2 R16.2 | R16.2
N$45
  Top 0.152: J2.1 16.08,103.91 16.08,100.68 15.73,100.33
  Top 1: F5.1 15.73,97.7 15.73,100.33 D17.C
N$46
  Top 0.508: J15.1 98.52,63.05 94.69,66.88 MS1.1' 94.63,71.7 94.35,71.98 94.35,76.09 94.69,76.43 MS1.1
N$47
  Top 0.152: 63.81,67.42 R27.1 63.92,66.4 | 63.92,66.4 63.92,66.31 63.81,66.21 | U$2.1 63.81,66.29 63.92,66.4
N$48
  Top 0.457: U$3.1 67.68,66.17 | R28.1 67.68,66.42 67.68,66.17 | 67.68,66.17
N$49
  Top 0.152: J12.2 61.74,65.41 61.14,65.41 60.3,64.57 60.3,62.13 61.54,60.89 U2.3 | 63.81,65.11 63.66,65.11 63.32,65.45 J12.2 | U$2.2 J12.2
N$50  (1 unrouted)
  Top 0.152: U2.2 62.44,62.13 61.65,62.13 60.66,63.12 60.66,63.83 61.52,64.69 65.09,64.69 J19.2 66.78,65.45 67.18,65.45 67.52,65.11 67.68,65.11
N$51
  Top 0.152: R24.1 J12.1
N$52
  Top 0.152: R25.1 65.95,65.97 J19.1
N$53
  Top 0.152: R26.1 J20.1
N$54
  Top 0.152: J20.2 69.73,65.27 | 69.73,65.27 68.77,64.31 65.94,64.31 65.06,63.43 U2.1 | 69.73,65.27 71.38,65.27 71.53,65.27 | 71.53,65.27 71.69,65.11 71.84,65.11 | U$7.2 71.66,65.27 71.53,65.27
N$55
  Top 0.152: R29.1 71.84,66.45 71.84,66.21 | 71.84,66.21 71.69,66.21 | U$7.1 71.84,66.21
N$57
  Top 0.152: J21.2 43.67,105.54 41.9,105.54 R17.2
N$58
  Top 1: J1.3 31.59,110.21 32.03,109.77 Q5.3
  pour Top (no thermals): 31.12,117.86 31.52,117.86 32.03,117.86 arc-90 32.24,117.65 32.24,111.05 arc90 32.84,110.44 arc-90 33.15,110.13 33.15,108.1 arc-90 32.74,107.7 30.2,107.7 arc-90 30.1,107.8 30.1,113.28 30.1,113.79 arc-90 30.3,114 30.41,114 arc90 31.02,114.6 31.02,116.84 31.02,117.65 31.02,117.75 arc-90
N$103  (via drill 1.02 pad 1.91)
  other vias: 93.5,48.26
N$104  (via drill 1.02 pad 1.91)
  other vias: 93.5,45.72
N$105  (via drill 1.02 pad 1.91)
  other vias: 93.5,43.18
N$106  (via drill 1.02 pad 1.91)
  other vias: 93.5,40.64
N$107  (via drill 1.02 pad 1.91)
  other vias: 93.5,38.1
N$108  (via drill 1.02 pad 1.91)
  other vias: 93.5,35.56
N$109  (via drill 1.02 pad 1.91)
  other vias: 93.5,33.02
N$110  (via drill 1.02 pad 1.91)
  other vias: 93.5,30.48
N$111  (via drill 1.02 pad 1.91)
  other vias: 93.5,27.94
N$112  (via drill 1.02 pad 1.91)
  other vias: 93.5,25.4
N$114  (via drill 1.02 pad 1.91)
  other vias: 96.04,48.26
N$115  (via drill 1.02 pad 1.91)
  other vias: 96.04,45.72
N$116  (via drill 1.02 pad 1.91)
  other vias: 96.04,43.18
N$117  (via drill 1.02 pad 1.91)
  other vias: 96.04,40.64
N$118  (via drill 1.02 pad 1.91)
  other vias: 96.04,38.1
N$119  (via drill 1.02 pad 1.91)
  other vias: 96.04,35.56
N$120  (via drill 1.02 pad 1.91)
  other vias: 96.04,33.02
N$121  (via drill 1.02 pad 1.91)
  other vias: 96.04,30.48
N$122  (via drill 1.02 pad 1.91)
  other vias: 96.04,27.94
N$123  (via drill 1.02 pad 1.91)
  other vias: 96.04,25.4
N$125  (via drill 1.02 pad 1.91)
  other vias: 98.58,48.26
N$126  (via drill 1.02 pad 1.91)
  other vias: 98.58,45.72
N$127  (via drill 1.02 pad 1.91)
  other vias: 98.58,43.18
N$128  (via drill 1.02 pad 1.91)
  other vias: 98.58,40.64
N$129  (via drill 1.02 pad 1.91)
  other vias: 98.58,38.1
N$130  (via drill 1.02 pad 1.91)
  other vias: 98.58,35.56
N$131  (via drill 1.02 pad 1.91)
  other vias: 98.58,33.02
N$132  (via drill 1.02 pad 1.91)
  other vias: 98.58,30.48
N$133  (via drill 1.02 pad 1.91)
  other vias: 98.58,27.94
N$134  (via drill 1.02 pad 1.91)
  other vias: 98.58,25.4
N$136  (via drill 1.02 pad 1.91)
  other vias: 101.12,48.26
N$137  (via drill 1.02 pad 1.91)
  other vias: 101.12,45.72
N$138  (via drill 1.02 pad 1.91)
  other vias: 101.12,43.18
N$139  (via drill 1.02 pad 1.91)
  other vias: 101.12,40.64
N$140  (via drill 1.02 pad 1.91)
  other vias: 101.12,38.1
N$141  (via drill 1.02 pad 1.91)
  other vias: 101.12,35.56
N$142  (via drill 1.02 pad 1.91)
  other vias: 101.12,33.02
N$143  (via drill 1.02 pad 1.91)
  other vias: 101.12,30.48
N$144  (via drill 1.02 pad 1.91)
  other vias: 101.12,27.94
N$145  (via drill 1.02 pad 1.91)
  other vias: 101.12,25.4
N$147  (via drill 1.02 pad 1.91)
  other vias: 103.66,48.26
N$148  (via drill 1.02 pad 1.91)
  other vias: 103.66,45.72
N$149  (via drill 1.02 pad 1.91)
  other vias: 103.66,43.18
N$150  (via drill 1.02 pad 1.91)
  other vias: 103.66,40.64
N$151  (via drill 1.02 pad 1.91)
  other vias: 103.66,38.1
N$152  (via drill 1.02 pad 1.91)
  other vias: 103.66,35.56
N$153  (via drill 1.02 pad 1.91)
  other vias: 103.66,33.02
N$154  (via drill 1.02 pad 1.91)
  other vias: 103.66,30.48
N$155  (via drill 1.02 pad 1.91)
  other vias: 103.66,27.94
N$156  (via drill 1.02 pad 1.91)
  other vias: 103.66,25.4
N$158  (via drill 1.02 pad 1.91)
  other vias: 106.2,48.26
N$159  (via drill 1.02 pad 1.91)
  other vias: 106.2,45.72
N$160  (via drill 1.02 pad 1.91)
  other vias: 106.2,43.18
N$161  (via drill 1.02 pad 1.91)
  other vias: 106.2,40.64
N$162  (via drill 1.02 pad 1.91)
  other vias: 106.2,38.1
N$163  (via drill 1.02 pad 1.91)
  other vias: 106.2,35.56
N$164  (via drill 1.02 pad 1.91)
  other vias: 106.2,33.02
N$165  (via drill 1.02 pad 1.91)
  other vias: 106.2,30.48
N$166  (via drill 1.02 pad 1.91)
  other vias: 106.2,27.94
N$167  (via drill 1.02 pad 1.91)
  other vias: 106.2,25.4
N$169  (via drill 1.02 pad 1.91)
  other vias: 108.74,48.26
N$170  (via drill 1.02 pad 1.91)
  other vias: 108.74,45.72
N$171  (via drill 1.02 pad 1.91)
  other vias: 108.74,43.18
N$172  (via drill 1.02 pad 1.91)
  other vias: 108.74,40.64
N$173  (via drill 1.02 pad 1.91)
  other vias: 108.74,38.1
N$174  (via drill 1.02 pad 1.91)
  other vias: 108.74,35.56
N$175  (via drill 1.02 pad 1.91)
  other vias: 108.74,33.02
N$176  (via drill 1.02 pad 1.91)
  other vias: 108.74,30.48
N$177  (via drill 1.02 pad 1.91)
  other vias: 108.74,27.94
N$178  (via drill 1.02 pad 1.91)
  other vias: 108.74,25.4
N$180  (via drill 1.02 pad 1.91)
  other vias: 111.28,48.26
N$181  (via drill 1.02 pad 1.91)
  other vias: 111.28,45.72
N$182  (via drill 1.02 pad 1.91)
  other vias: 111.28,43.18
N$183  (via drill 1.02 pad 1.91)
  other vias: 111.28,40.64
N$184  (via drill 1.02 pad 1.91)
  other vias: 111.28,38.1
N$185  (via drill 1.02 pad 1.91)
  other vias: 111.28,35.56
N$186  (via drill 1.02 pad 1.91)
  other vias: 111.28,33.02
N$187  (via drill 1.02 pad 1.91)
  other vias: 111.28,30.48
N$188  (via drill 1.02 pad 1.91)
  other vias: 111.28,27.94
N$189  (via drill 1.02 pad 1.91)
  other vias: 111.28,25.4
N$191  (via drill 1.02 pad 1.91)
  other vias: 113.82,48.26
N$192  (via drill 1.02 pad 1.91)
  other vias: 113.82,45.72
N$193  (via drill 1.02 pad 1.91)
  other vias: 113.82,43.18
N$194  (via drill 1.02 pad 1.91)
  other vias: 113.82,40.64
N$195  (via drill 1.02 pad 1.91)
  other vias: 113.82,38.1
N$196  (via drill 1.02 pad 1.91)
  other vias: 113.82,35.56
N$197  (via drill 1.02 pad 1.91)
  other vias: 113.82,33.02
N$198  (via drill 1.02 pad 1.91)
  other vias: 113.82,30.48
N$199  (via drill 1.02 pad 1.91)
  other vias: 113.82,27.94
N$200  (via drill 1.02 pad 1.91)
  other vias: 113.82,25.4
N$202  (via drill 1.02 pad 1.91)
  other vias: 116.36,48.26
N$203  (via drill 1.02 pad 1.91)
  other vias: 116.36,45.72
N$204  (via drill 1.02 pad 1.91)
  other vias: 116.36,43.18
N$205  (via drill 1.02 pad 1.91)
  other vias: 116.36,40.64
N$206  (via drill 1.02 pad 1.91)
  other vias: 116.36,38.1
N$207  (via drill 1.02 pad 1.91)
  other vias: 116.36,35.56
N$208  (via drill 1.02 pad 1.91)
  other vias: 116.36,33.02
N$209  (via drill 1.02 pad 1.91)
  other vias: 116.36,30.48
N$210  (via drill 1.02 pad 1.91)
  other vias: 116.36,27.94
N$211  (via drill 1.02 pad 1.91)
  other vias: 116.36,25.4
N$213  (via drill 1.02 pad 1.91)
  other vias: 118.9,48.26
N$214  (via drill 1.02 pad 1.91)
  other vias: 118.9,45.72
N$215  (via drill 1.02 pad 1.91)
  other vias: 118.9,43.18
N$216  (via drill 1.02 pad 1.91)
  other vias: 118.9,40.64
N$217  (via drill 1.02 pad 1.91)
  other vias: 118.9,38.1
N$218  (via drill 1.02 pad 1.91)
  other vias: 118.9,35.56
N$219  (via drill 1.02 pad 1.91)
  other vias: 118.9,33.02
N$220  (via drill 1.02 pad 1.91)
  other vias: 118.9,30.48
N$221  (via drill 1.02 pad 1.91)
  other vias: 118.9,27.94
N$222  (via drill 1.02 pad 1.91)
  other vias: 118.9,25.4
N$224  (via drill 1.02 pad 1.91)
  other vias: 121.44,48.26
N$225  (via drill 1.02 pad 1.91)
  other vias: 121.44,45.72
N$226  (via drill 1.02 pad 1.91)
  other vias: 121.44,43.18
N$227  (via drill 1.02 pad 1.91)
  other vias: 121.44,40.64
N$228  (via drill 1.02 pad 1.91)
  other vias: 121.44,38.1
N$229  (via drill 1.02 pad 1.91)
  other vias: 121.44,35.56
N$230  (via drill 1.02 pad 1.91)
  other vias: 121.44,33.02
N$231  (via drill 1.02 pad 1.91)
  other vias: 121.44,30.48
N$232  (via drill 1.02 pad 1.91)
  other vias: 121.44,27.94
N$233  (via drill 1.02 pad 1.91)
  other vias: 121.44,25.4
N$235  (via drill 1.02 pad 1.91)
  other vias: 123.98,48.26
N$236  (via drill 1.02 pad 1.91)
  other vias: 123.98,45.72
N$237  (via drill 1.02 pad 1.91)
  other vias: 123.98,43.18
N$238  (via drill 1.02 pad 1.91)
  other vias: 123.98,40.64
N$239  (via drill 1.02 pad 1.91)
  other vias: 123.98,38.1
N$240  (via drill 1.02 pad 1.91)
  other vias: 123.98,35.56
N$241  (via drill 1.02 pad 1.91)
  other vias: 123.98,33.02
N$242  (via drill 1.02 pad 1.91)
  other vias: 123.98,30.48
N$243  (via drill 1.02 pad 1.91)
  other vias: 123.98,27.94
N$244  (via drill 1.02 pad 1.91)
  other vias: 123.98,25.4
N$246  (via drill 1.02 pad 1.91)
  other vias: 126.52,48.26
N$247  (via drill 1.02 pad 1.91)
  other vias: 126.52,45.72
N$248  (via drill 1.02 pad 1.91)
  other vias: 126.52,43.18
N$249  (via drill 1.02 pad 1.91)
  other vias: 126.52,40.64
N$250  (via drill 1.02 pad 1.91)
  other vias: 126.52,38.1
N$251  (via drill 1.02 pad 1.91)
  other vias: 126.52,35.56
N$252  (via drill 1.02 pad 1.91)
  other vias: 126.52,33.02
N$253  (via drill 1.02 pad 1.91)
  other vias: 126.52,30.48
N$254  (via drill 1.02 pad 1.91)
  other vias: 126.52,27.94
N$255  (via drill 1.02 pad 1.91)
  other vias: 126.52,25.4
N$257  (via drill 1.02 pad 1.91)
  other vias: 129.06,48.26
N$258  (via drill 1.02 pad 1.91)
  other vias: 129.06,45.72
N$259  (via drill 1.02 pad 1.91)
  other vias: 129.06,43.18
N$260  (via drill 1.02 pad 1.91)
  other vias: 129.06,40.64
N$261  (via drill 1.02 pad 1.91)
  other vias: 129.06,38.1
N$262  (via drill 1.02 pad 1.91)
  other vias: 129.06,35.56
N$263  (via drill 1.02 pad 1.91)
  other vias: 129.06,33.02
N$264  (via drill 1.02 pad 1.91)
  other vias: 129.06,30.48
N$265  (via drill 1.02 pad 1.91)
  other vias: 129.06,27.94
N$266  (via drill 1.02 pad 1.91)
  other vias: 129.06,25.4
N$268  (via drill 1.02 pad 1.91)
  other vias: 131.6,48.26
N$269  (via drill 1.02 pad 1.91)
  other vias: 131.6,45.72
N$270  (via drill 1.02 pad 1.91)
  other vias: 131.6,43.18
N$271  (via drill 1.02 pad 1.91)
  other vias: 131.6,40.64
N$272  (via drill 1.02 pad 1.91)
  other vias: 131.6,38.1
N$273  (via drill 1.02 pad 1.91)
  other vias: 131.6,35.56
N$274  (via drill 1.02 pad 1.91)
  other vias: 131.6,33.02
N$275  (via drill 1.02 pad 1.91)
  other vias: 131.6,30.48
N$276  (via drill 1.02 pad 1.91)
  other vias: 131.6,27.94
N$277  (via drill 1.02 pad 1.91)
  other vias: 131.6,25.4
N$279  (via drill 1.02 pad 1.91)
  other vias: 134.14,48.26
N$280  (via drill 1.02 pad 1.91)
  other vias: 134.14,45.72
N$281  (via drill 1.02 pad 1.91)
  other vias: 134.14,43.18
N$282  (via drill 1.02 pad 1.91)
  other vias: 134.14,40.64
N$283  (via drill 1.02 pad 1.91)
  other vias: 134.14,38.1
N$284  (via drill 1.02 pad 1.91)
  other vias: 134.14,35.56
N$285  (via drill 1.02 pad 1.91)
  other vias: 134.14,33.02
N$286  (via drill 1.02 pad 1.91)
  other vias: 134.14,30.48
N$287  (via drill 1.02 pad 1.91)
  other vias: 134.14,27.94
N$288  (via drill 1.02 pad 1.91)
  other vias: 134.14,25.4
N$290  (via drill 1.02 pad 1.91)
  other vias: 136.68,48.26
N$291  (via drill 1.02 pad 1.91)
  other vias: 136.68,45.72
N$292  (via drill 1.02 pad 1.91)
  other vias: 136.68,43.18
N$293  (via drill 1.02 pad 1.91)
  other vias: 136.68,40.64
N$294  (via drill 1.02 pad 1.91)
  other vias: 136.68,38.1
N$295  (via drill 1.02 pad 1.91)
  other vias: 136.68,35.56
N$296  (via drill 1.02 pad 1.91)
  other vias: 136.68,33.02
N$297  (via drill 1.02 pad 1.91)
  other vias: 136.68,30.48
N$298  (via drill 1.02 pad 1.91)
  other vias: 136.68,27.94
N$299  (via drill 1.02 pad 1.91)
  other vias: 136.68,25.4
N$300
  Top 0.152: R30.2 35.55,107.22 Q3.2
  Top 1: Q5.2 33.71,106.82 Q3.2
  pour Top: 32.44,106.78 32.44,105.66 arc90 32.64,105.46 33.86,105.46 34.27,105.46 arc90 35.79,106.98 35.79,108.61 arc90 35.69,108.71 34.57,108.71 34.37,108.71 arc90 34.17,108.51 34.17,107.49 arc-90 33.96,107.29 33.15,107.29 32.84,107.29 arc90 32.44,106.88
N$301  (via drill 0.2 pad 0.41)
  Top 0.152: R31.1 31.31,105.87 Q5.1 v30.18,106.09 v30.18,106.1 | v36.55,109.68 36.65,109.58 R30.1
  Top 1: R30.1 37.05,107.96 Q3.1
  Bottom 0.152: v30.18,106.1 32.97,106.1 v36.55,109.68
N$302  (via drill 0.2 pad 0.41)
  Top 0.152: R31.2 32.32,104.62 v32.92,104.62 | S4.6 S4.3
  Bottom 0.152: v32.92,104.62 41.18,112.89 S4.6
N$336  (via drill 1.02 pad 1.91)
  other vias: 93.5,22.86
N$337  (via drill 1.02 pad 1.91)
  other vias: 96.04,22.86
N$338  (via drill 1.02 pad 1.91)
  other vias: 98.58,22.86
N$339  (via drill 1.02 pad 1.91)
  other vias: 101.12,22.86
N$340  (via drill 1.02 pad 1.91)
  other vias: 103.66,22.86
N$341  (via drill 1.02 pad 1.91)
  other vias: 106.2,22.86
N$342  (via drill 1.02 pad 1.91)
  other vias: 108.74,22.86
N$343  (via drill 1.02 pad 1.91)
  other vias: 111.28,22.86
N$344  (via drill 1.02 pad 1.91)
  other vias: 113.82,22.86
N$345  (via drill 1.02 pad 1.91)
  other vias: 116.36,22.86
N$346  (via drill 1.02 pad 1.91)
  other vias: 118.9,22.86
N$347  (via drill 1.02 pad 1.91)
  other vias: 121.44,22.86
N$348  (via drill 1.02 pad 1.91)
  other vias: 123.98,22.86
N$349  (via drill 1.02 pad 1.91)
  other vias: 126.52,22.86
N$350  (via drill 1.02 pad 1.91)
  other vias: 129.06,22.86
N$351  (via drill 1.02 pad 1.91)
  other vias: 131.6,22.86
N$352  (via drill 1.02 pad 1.91)
  other vias: 134.14,22.86
N$353  (via drill 1.02 pad 1.91)
  other vias: 136.68,22.86
NFC1  (via drill 0.2 pad 0.41, 0.3 pad 0.51)  (1 unrouted)
  Top 0.152: U$4.17 80.05,45.82 v79.89,45.66 | J3.11 83.51,6.38 v83.51,8.59 v83.5,8.6
  Top 0.203: v15.28,6.09 15.68,5.68 NFC.2@2 NFC.2@1 12.78,4.39 R37.1
  GND 0.152: v83.5,8.6 83.5,13.47 83.92,13.89 83.92,31.85 83.11,32.66 83.11,44.22 81.41,45.92 81.16,45.92 81.03,46.05 80.28,46.05 v79.89,45.66
  Bottom 0.152: v83.5,8.6 83.5,6.95 TP3.TP 83.69,6.11 81.72,4.14 15.7,4.14 15.67,4.17
NFC2  (via drill 0.2 pad 0.41, 0.3 pad 0.51)  (1 unrouted)
  Top 0.152: U$4.19 80.81,45.32 v80.75,45.26 | v81.1,8.8 81.1,8.31 81.1,7.1 | 81.1,7.1 81,7 | 81.1,7.1 J3.13
  Top 0.203: NFC.1 14.33,6.73 | 14.33,6.73 14.33,6.77 v14.36,6.8 | R38.2 14.28,6.78 14.33,6.73
  GND 0.152: v80.75,45.26 81.1,45.26 82.78,43.59 82.78,10.48 v81.1,8.8
  Bottom 0.152: v14.36,6.8 17.03,6.8 18.93,4.9 80.67,4.9 81.16,5.39 TP4.TP
PWM0  (via drill 0.2 pad 0.41)
  Top 0.152: v69.47,33.52 70.43,33.52 74.93,33.52 U$4.66 | J3.52 32.83,14.84 v32.74,14.94 32.74,16.61 40.82,24.69 v66.33,24.69 | J6.P$23 J6.23 47.45,96.21 v47.45,98.15 | v117.99,116.08 117.99,113.38 J10.15
  GND 0.152: v117.99,116.08 116.49,117.58 110.39,117.58 104.62,111.81 88.3,111.81 74.81,98.32 47.65,98.32 47.48,98.15 v47.45,98.15 | J6.P$23 47.35,92.99 45.6,91.24 44.15,91.24 43.69,90.78 43.69,89.81 43.92,89.59 63.76,89.59 69.88,83.46 69.88,71.4 71.86,69.42 71.86,45.29 71,44.42 69.67,44.42 68.02,42.77 68.02,34.97 v69.47,33.52